# Altium project Driver.PrjPcb
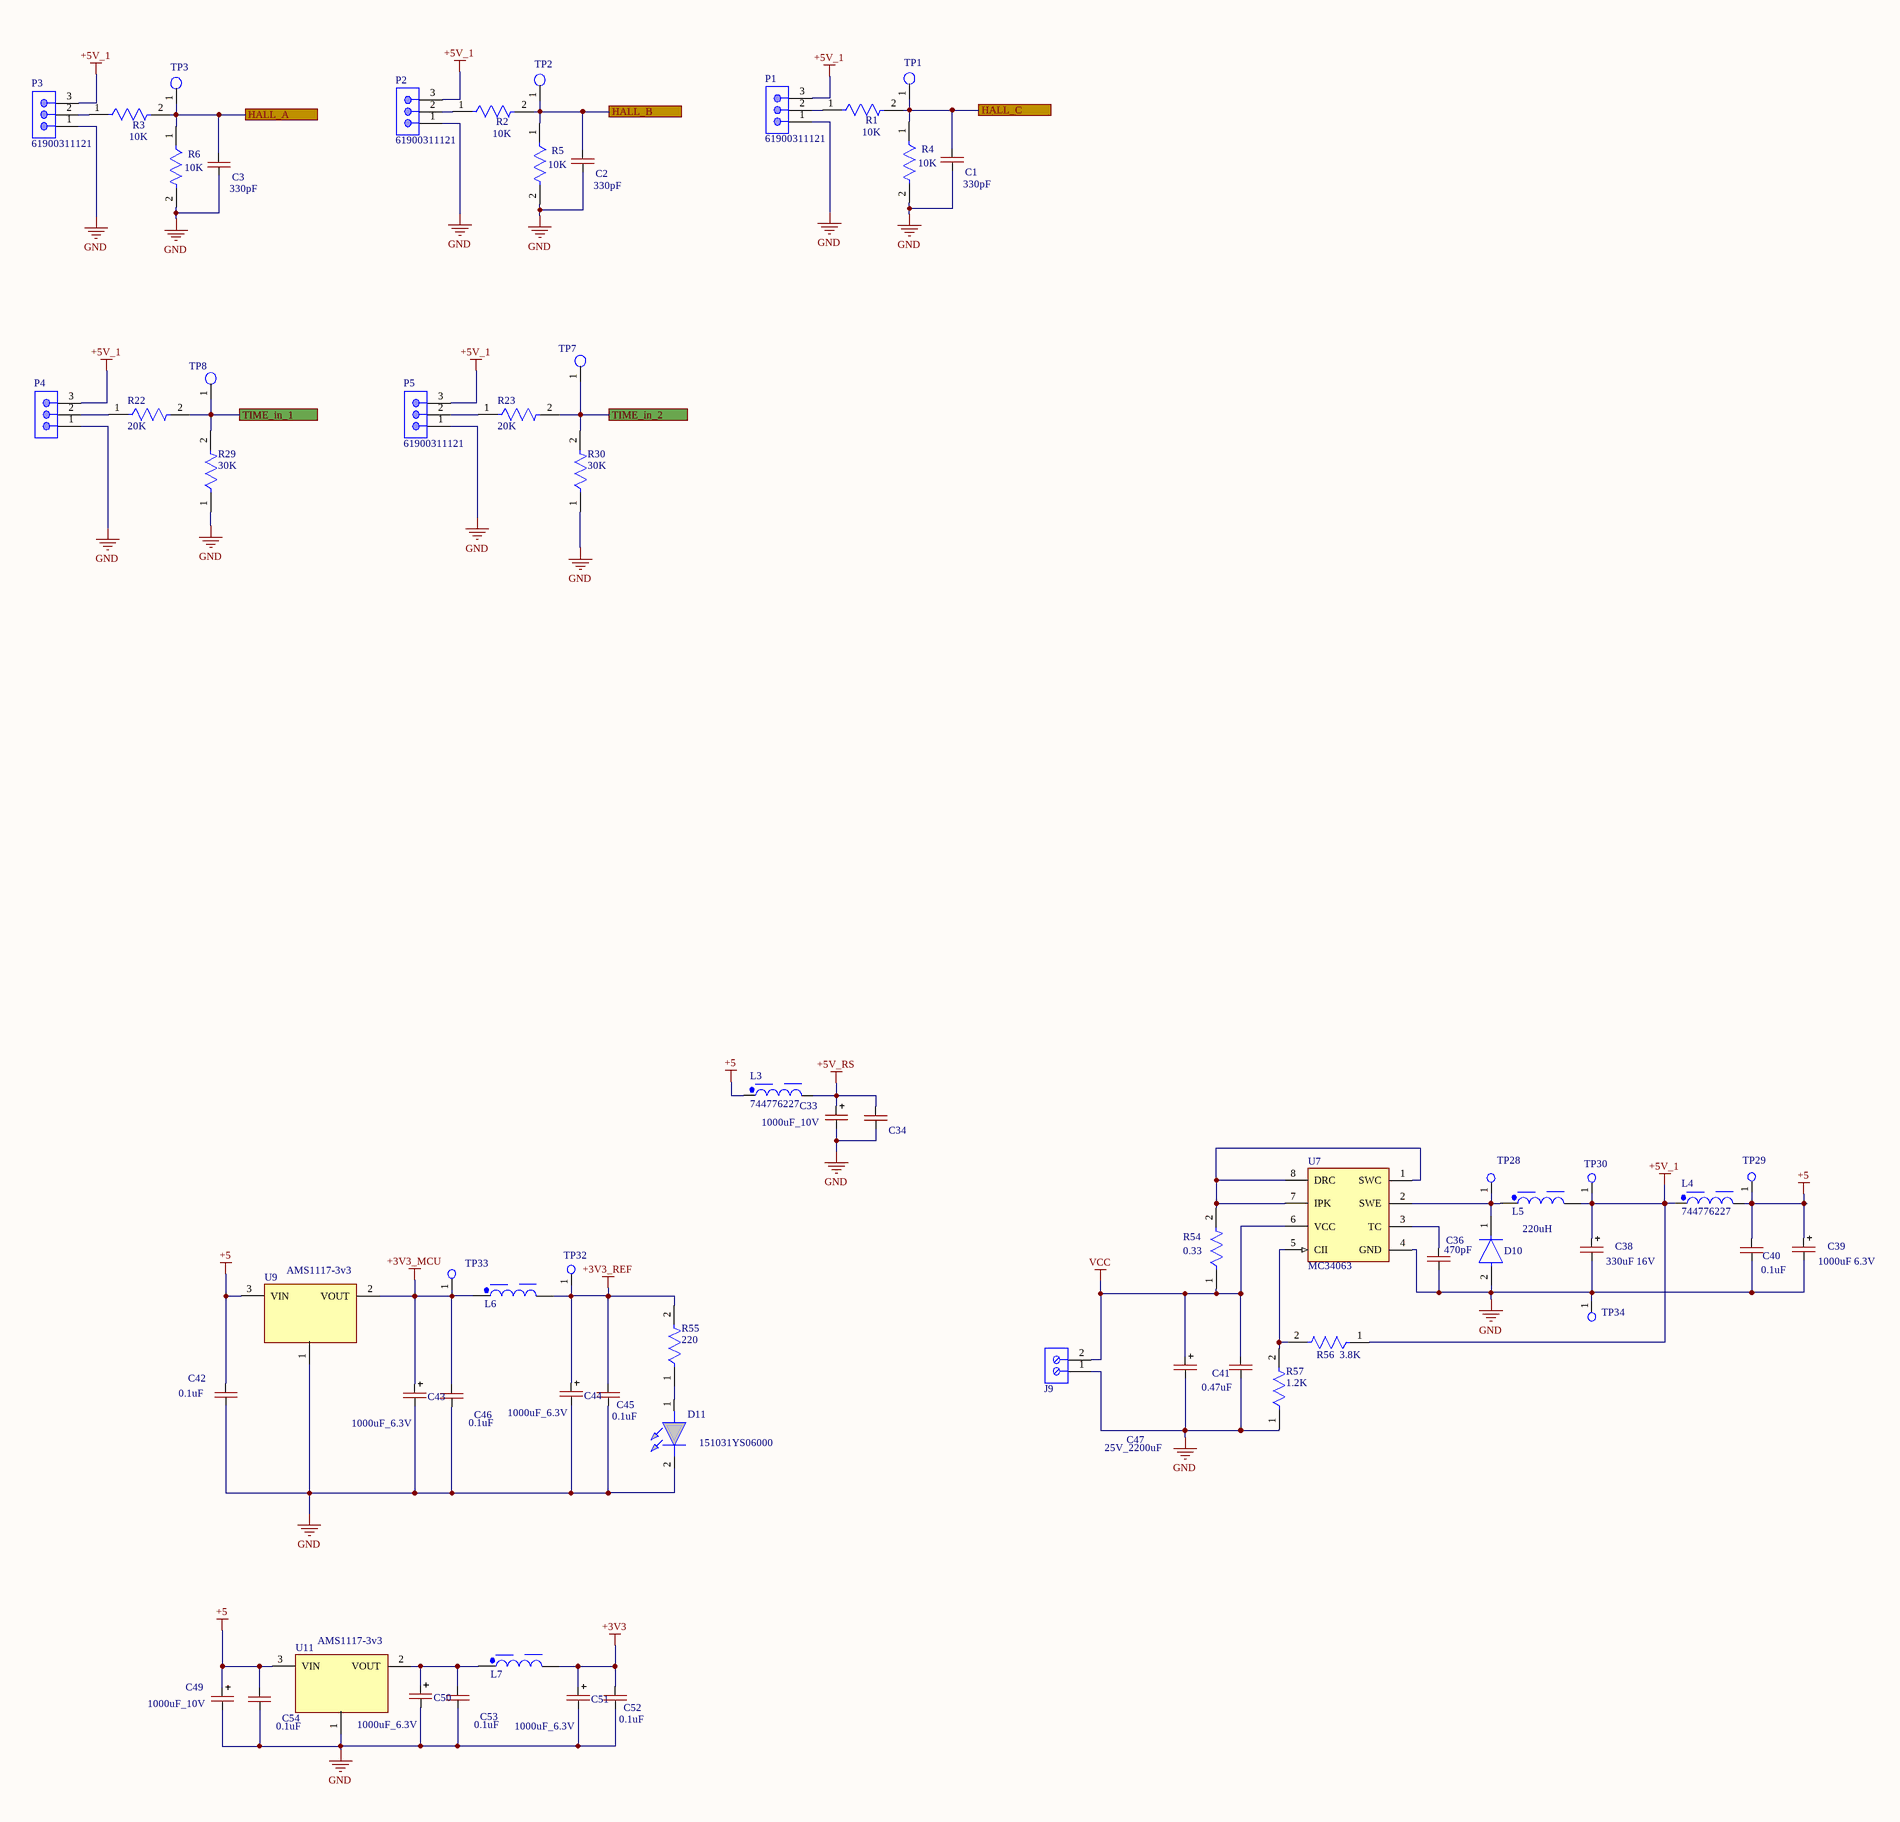
[diagram p0: Driver.SchDoc, top column 1 of 4]
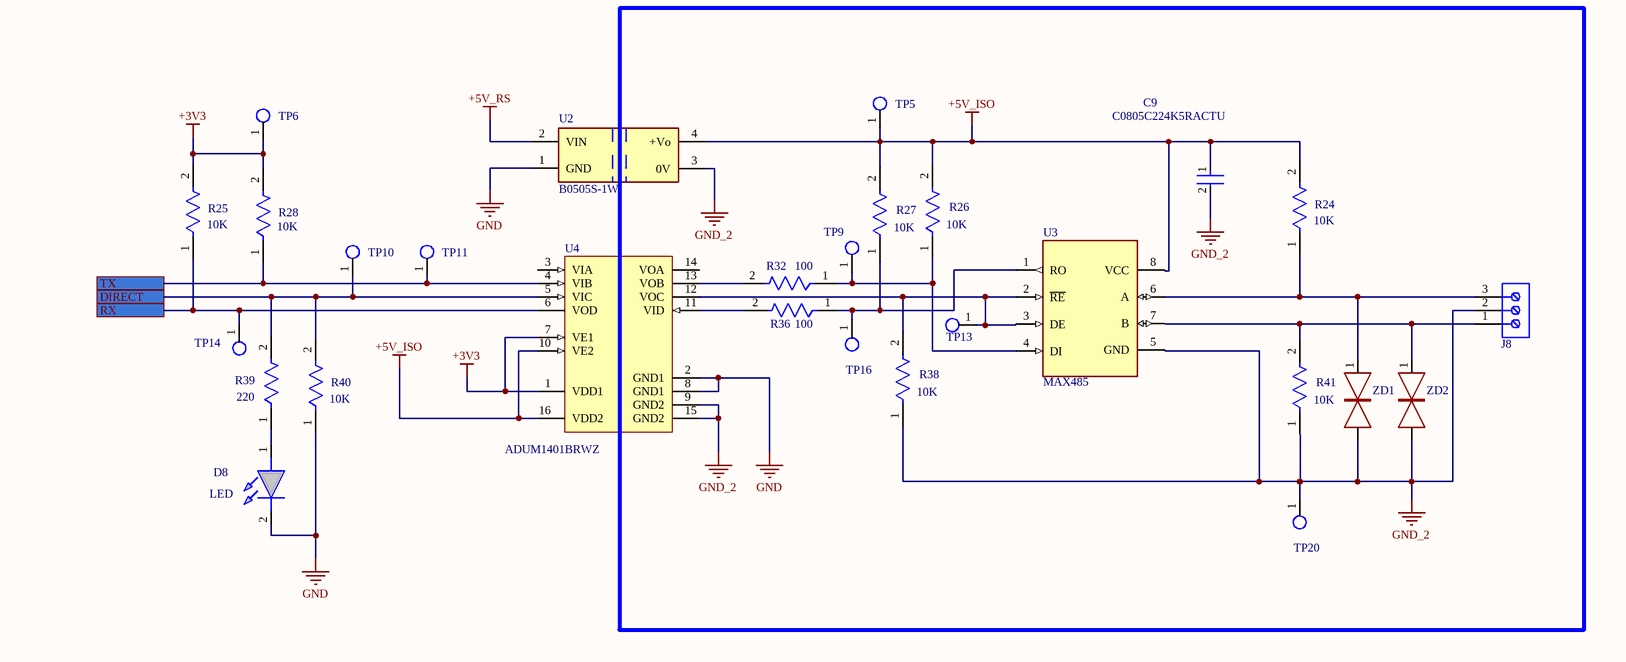
[diagram p1: Driver.SchDoc, top column 2 of 4]
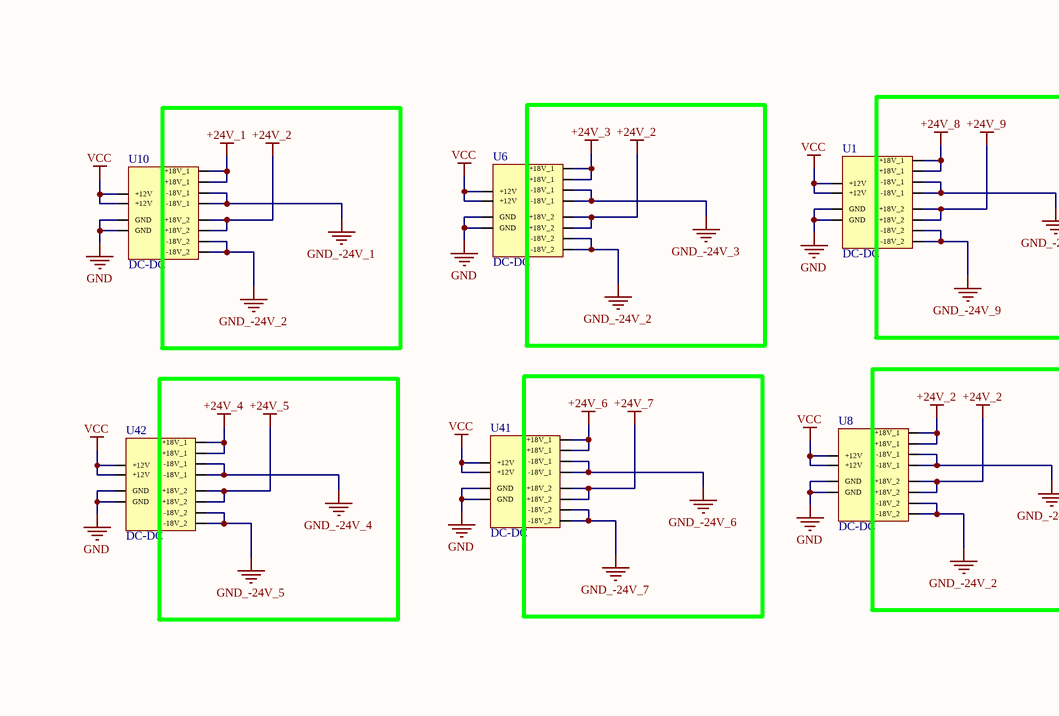
[diagram p2: Driver.SchDoc, top column 3 of 4]
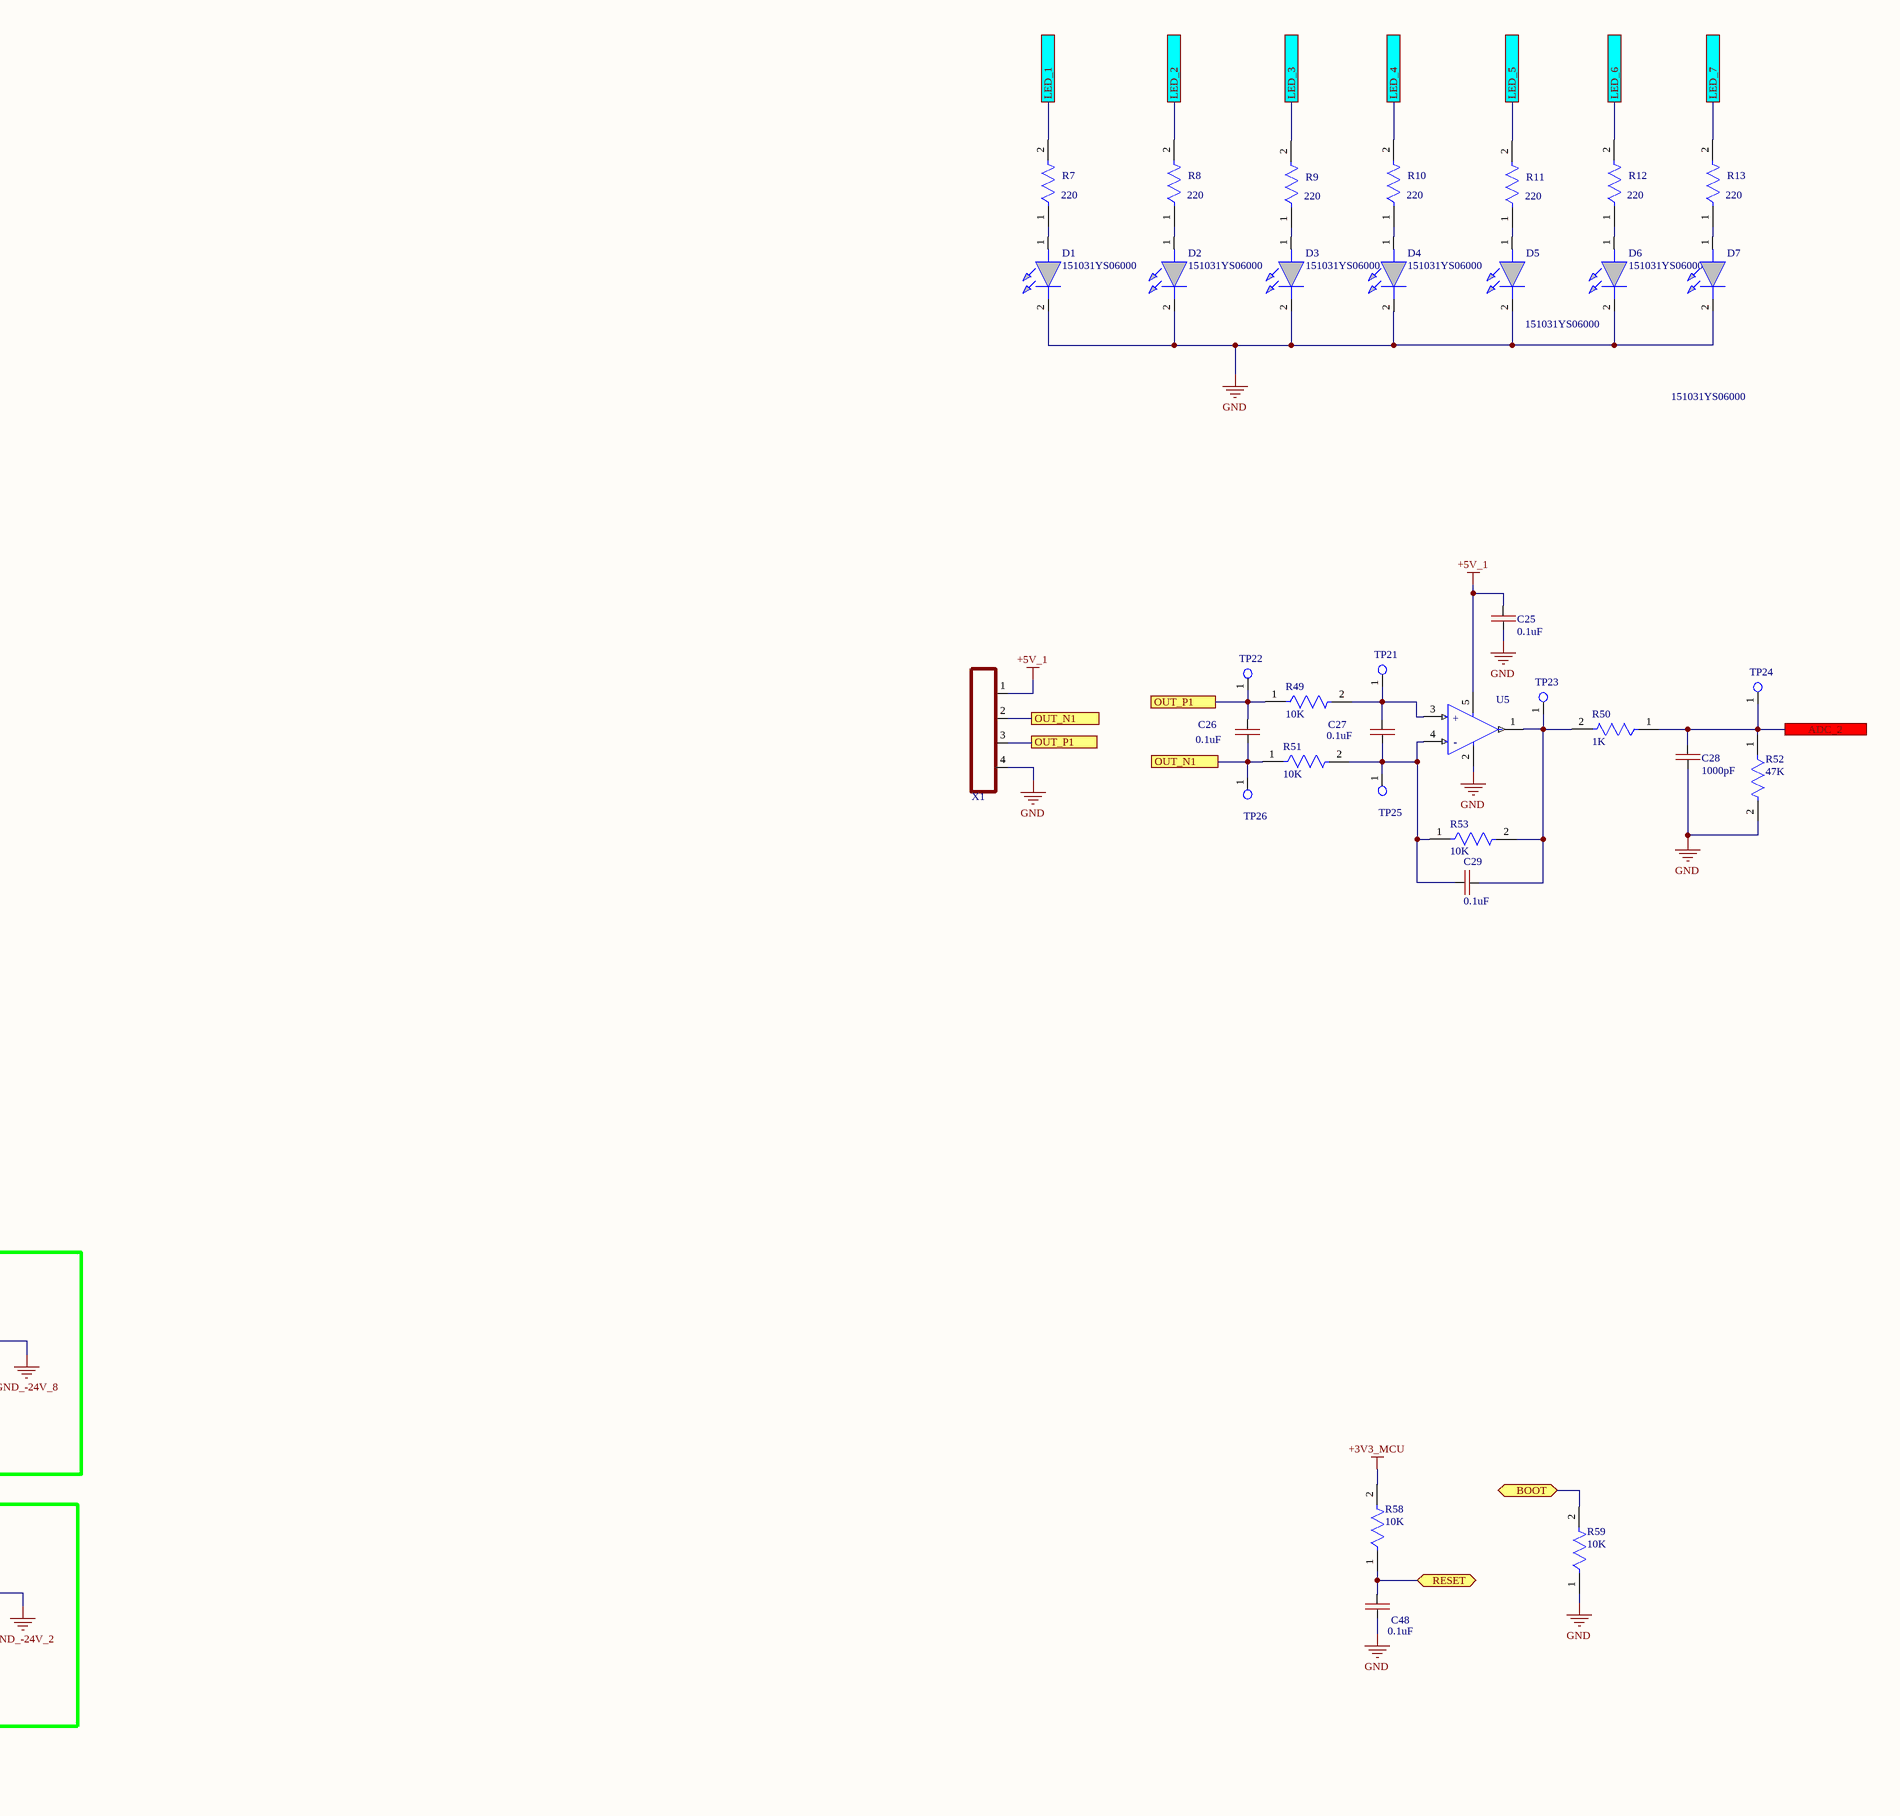
[diagram p3: Driver.SchDoc, top column 4 of 4]
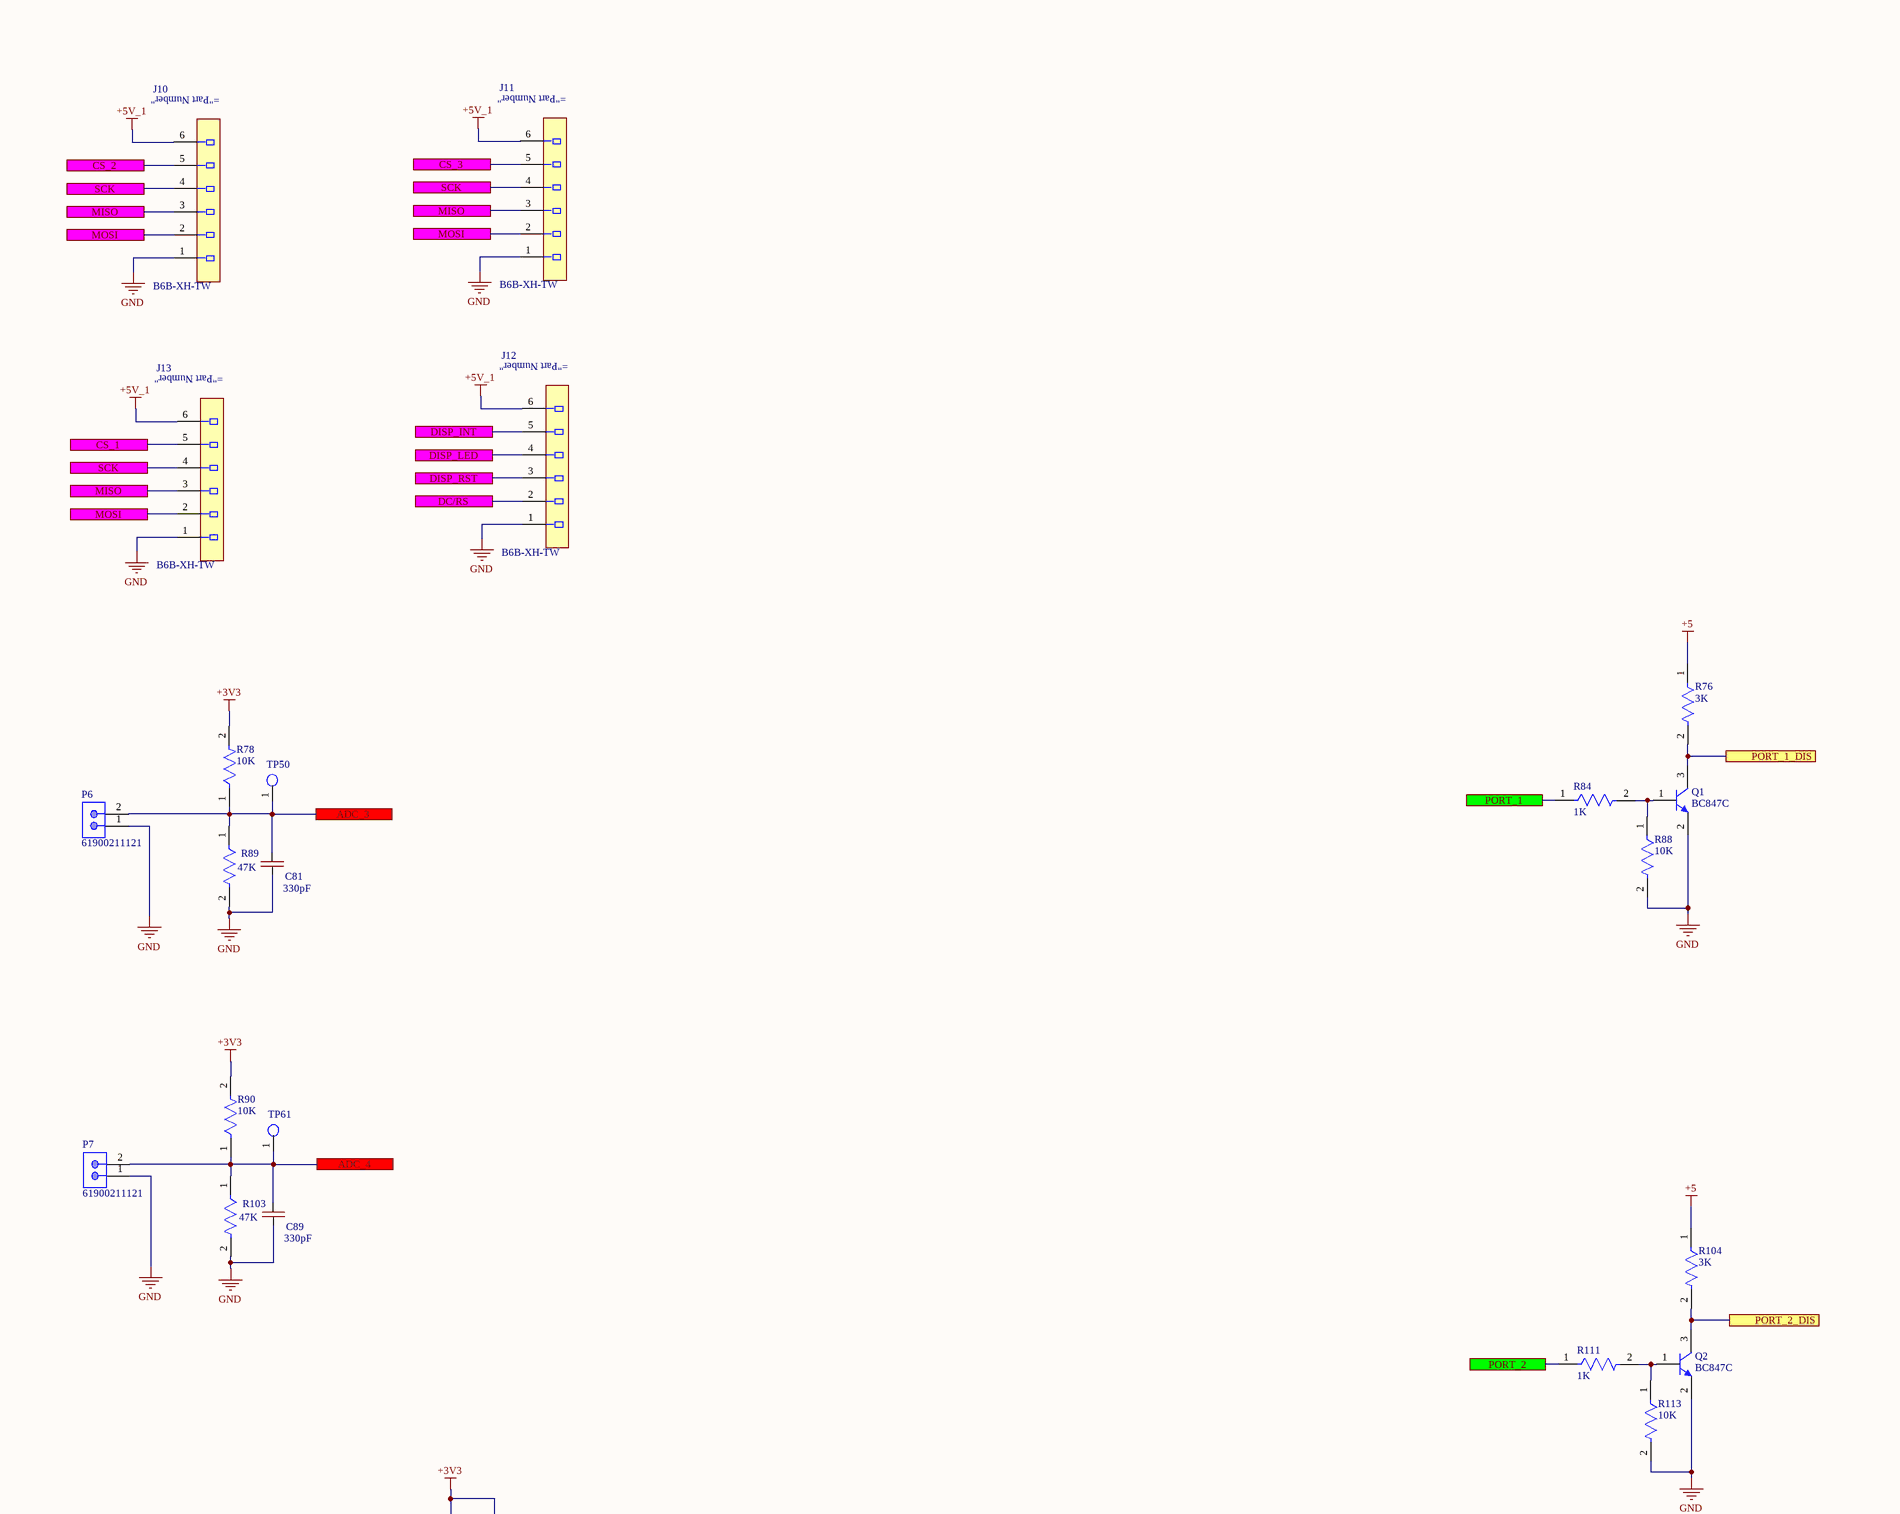
[diagram p4: Driver.SchDoc, centre column 1 of 4]
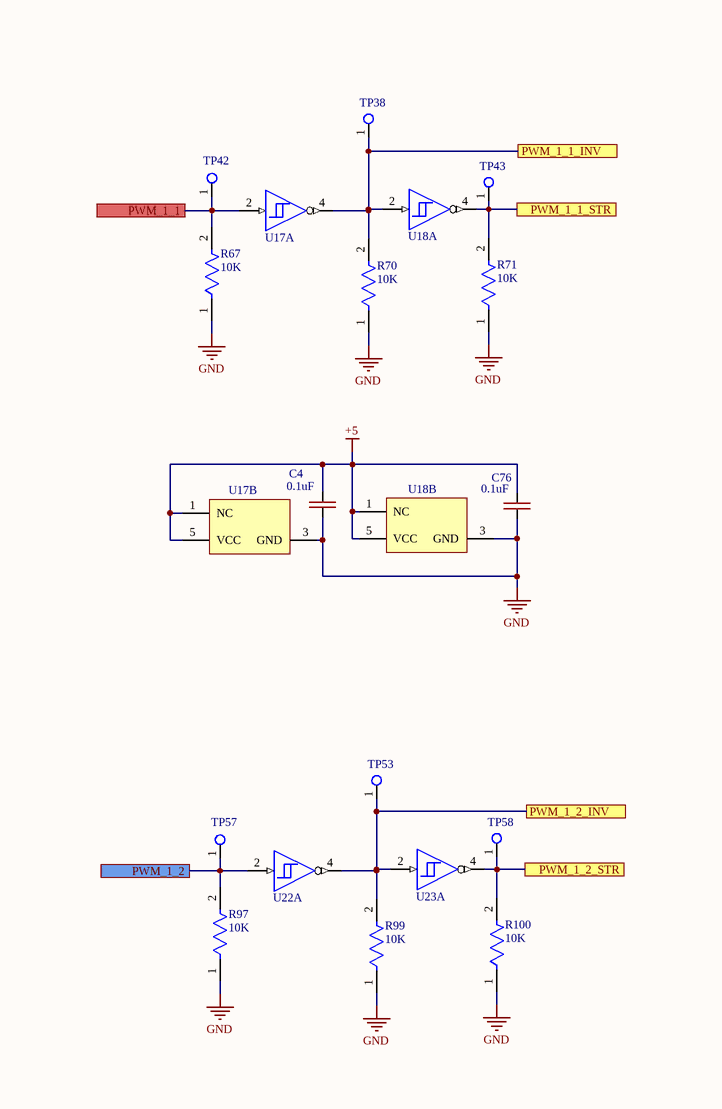
[diagram p5: Driver.SchDoc, centre column 2 of 4]
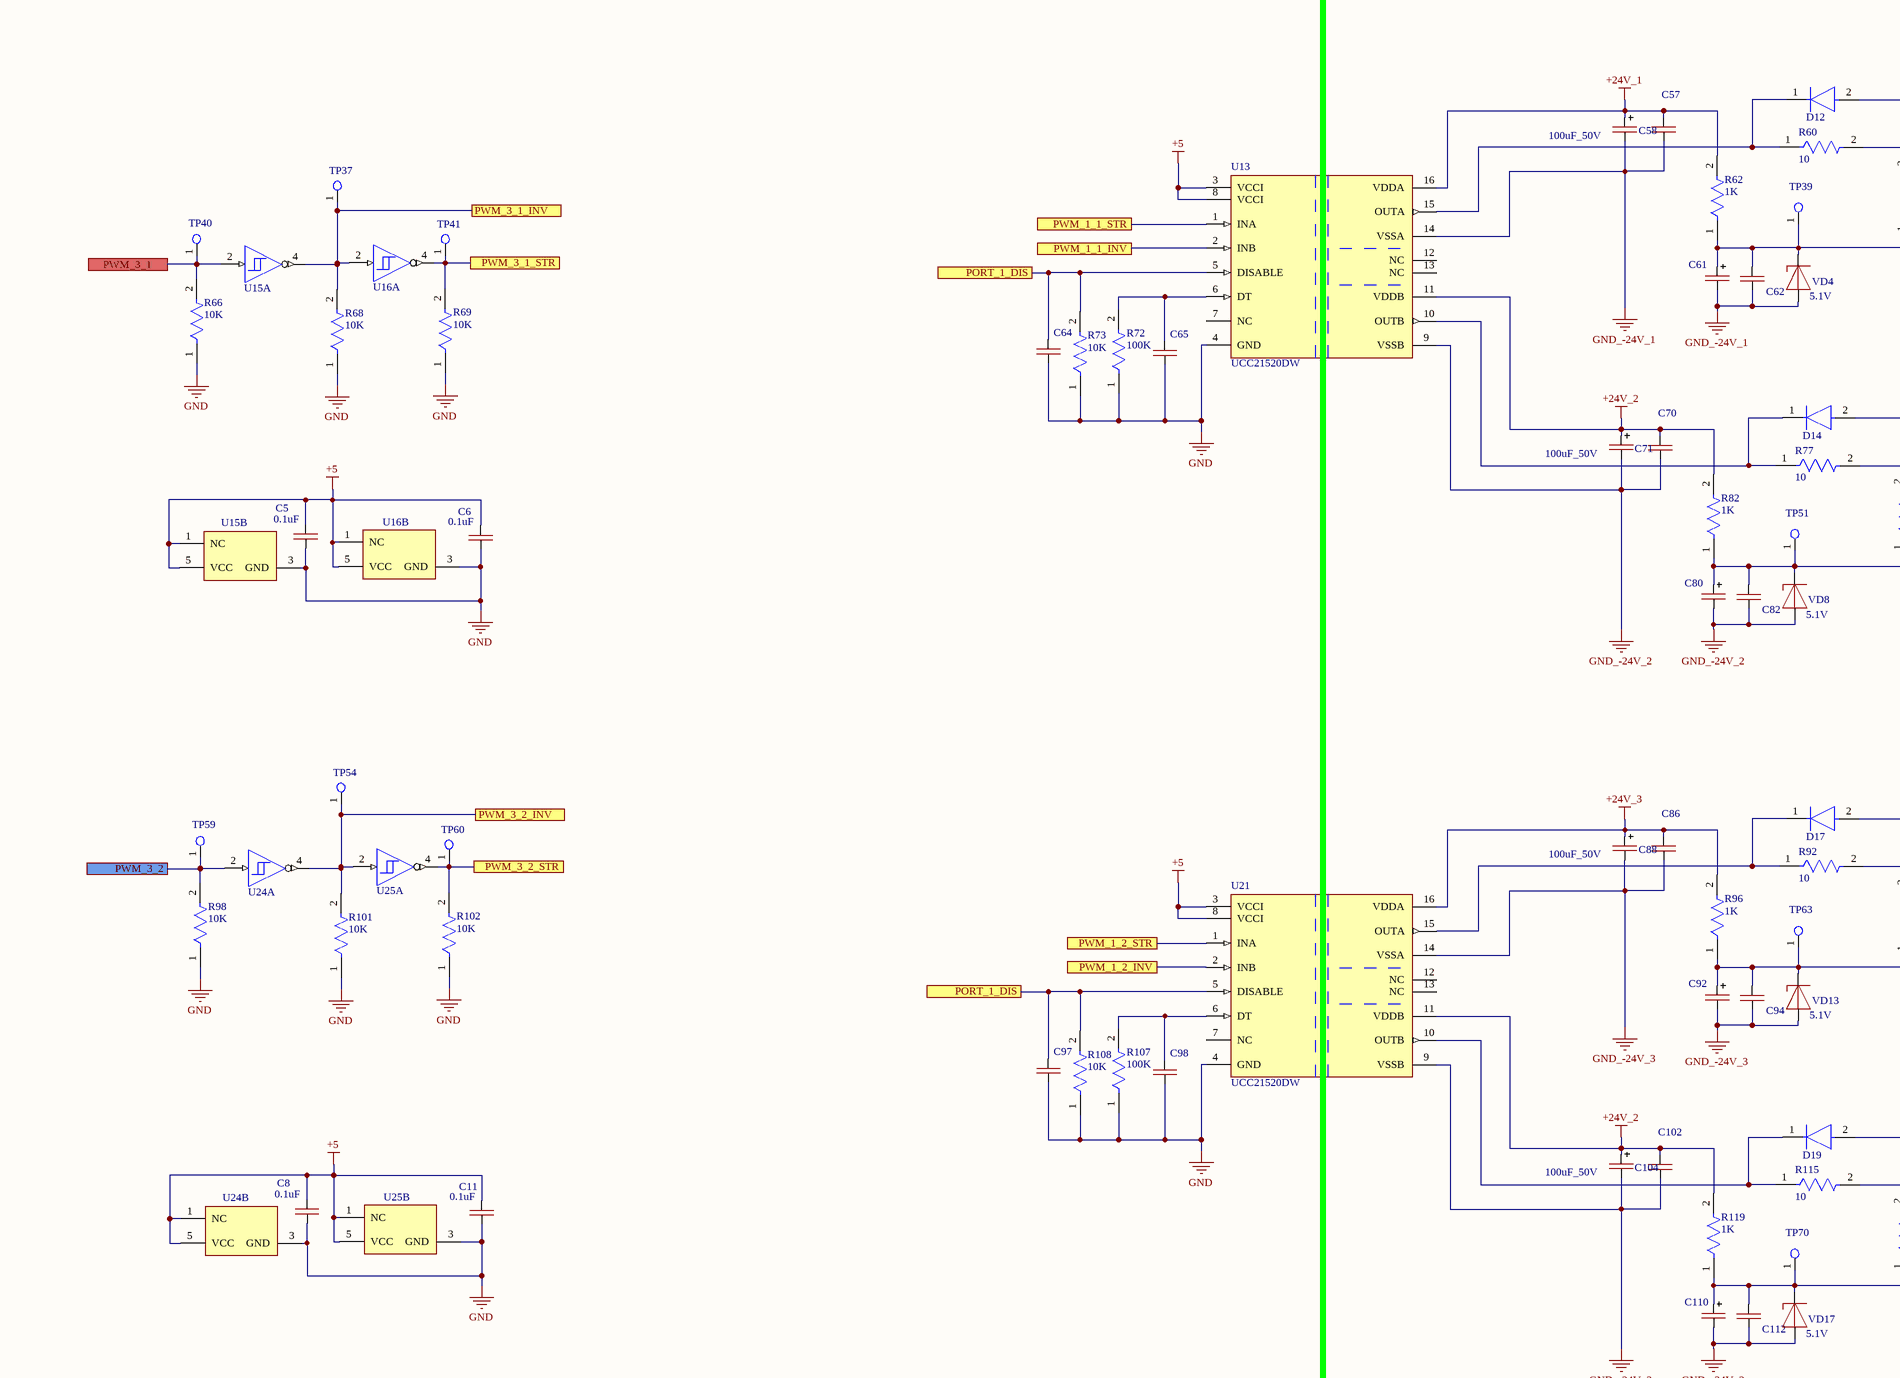
[diagram p6: Driver.SchDoc, centre column 3 of 4]
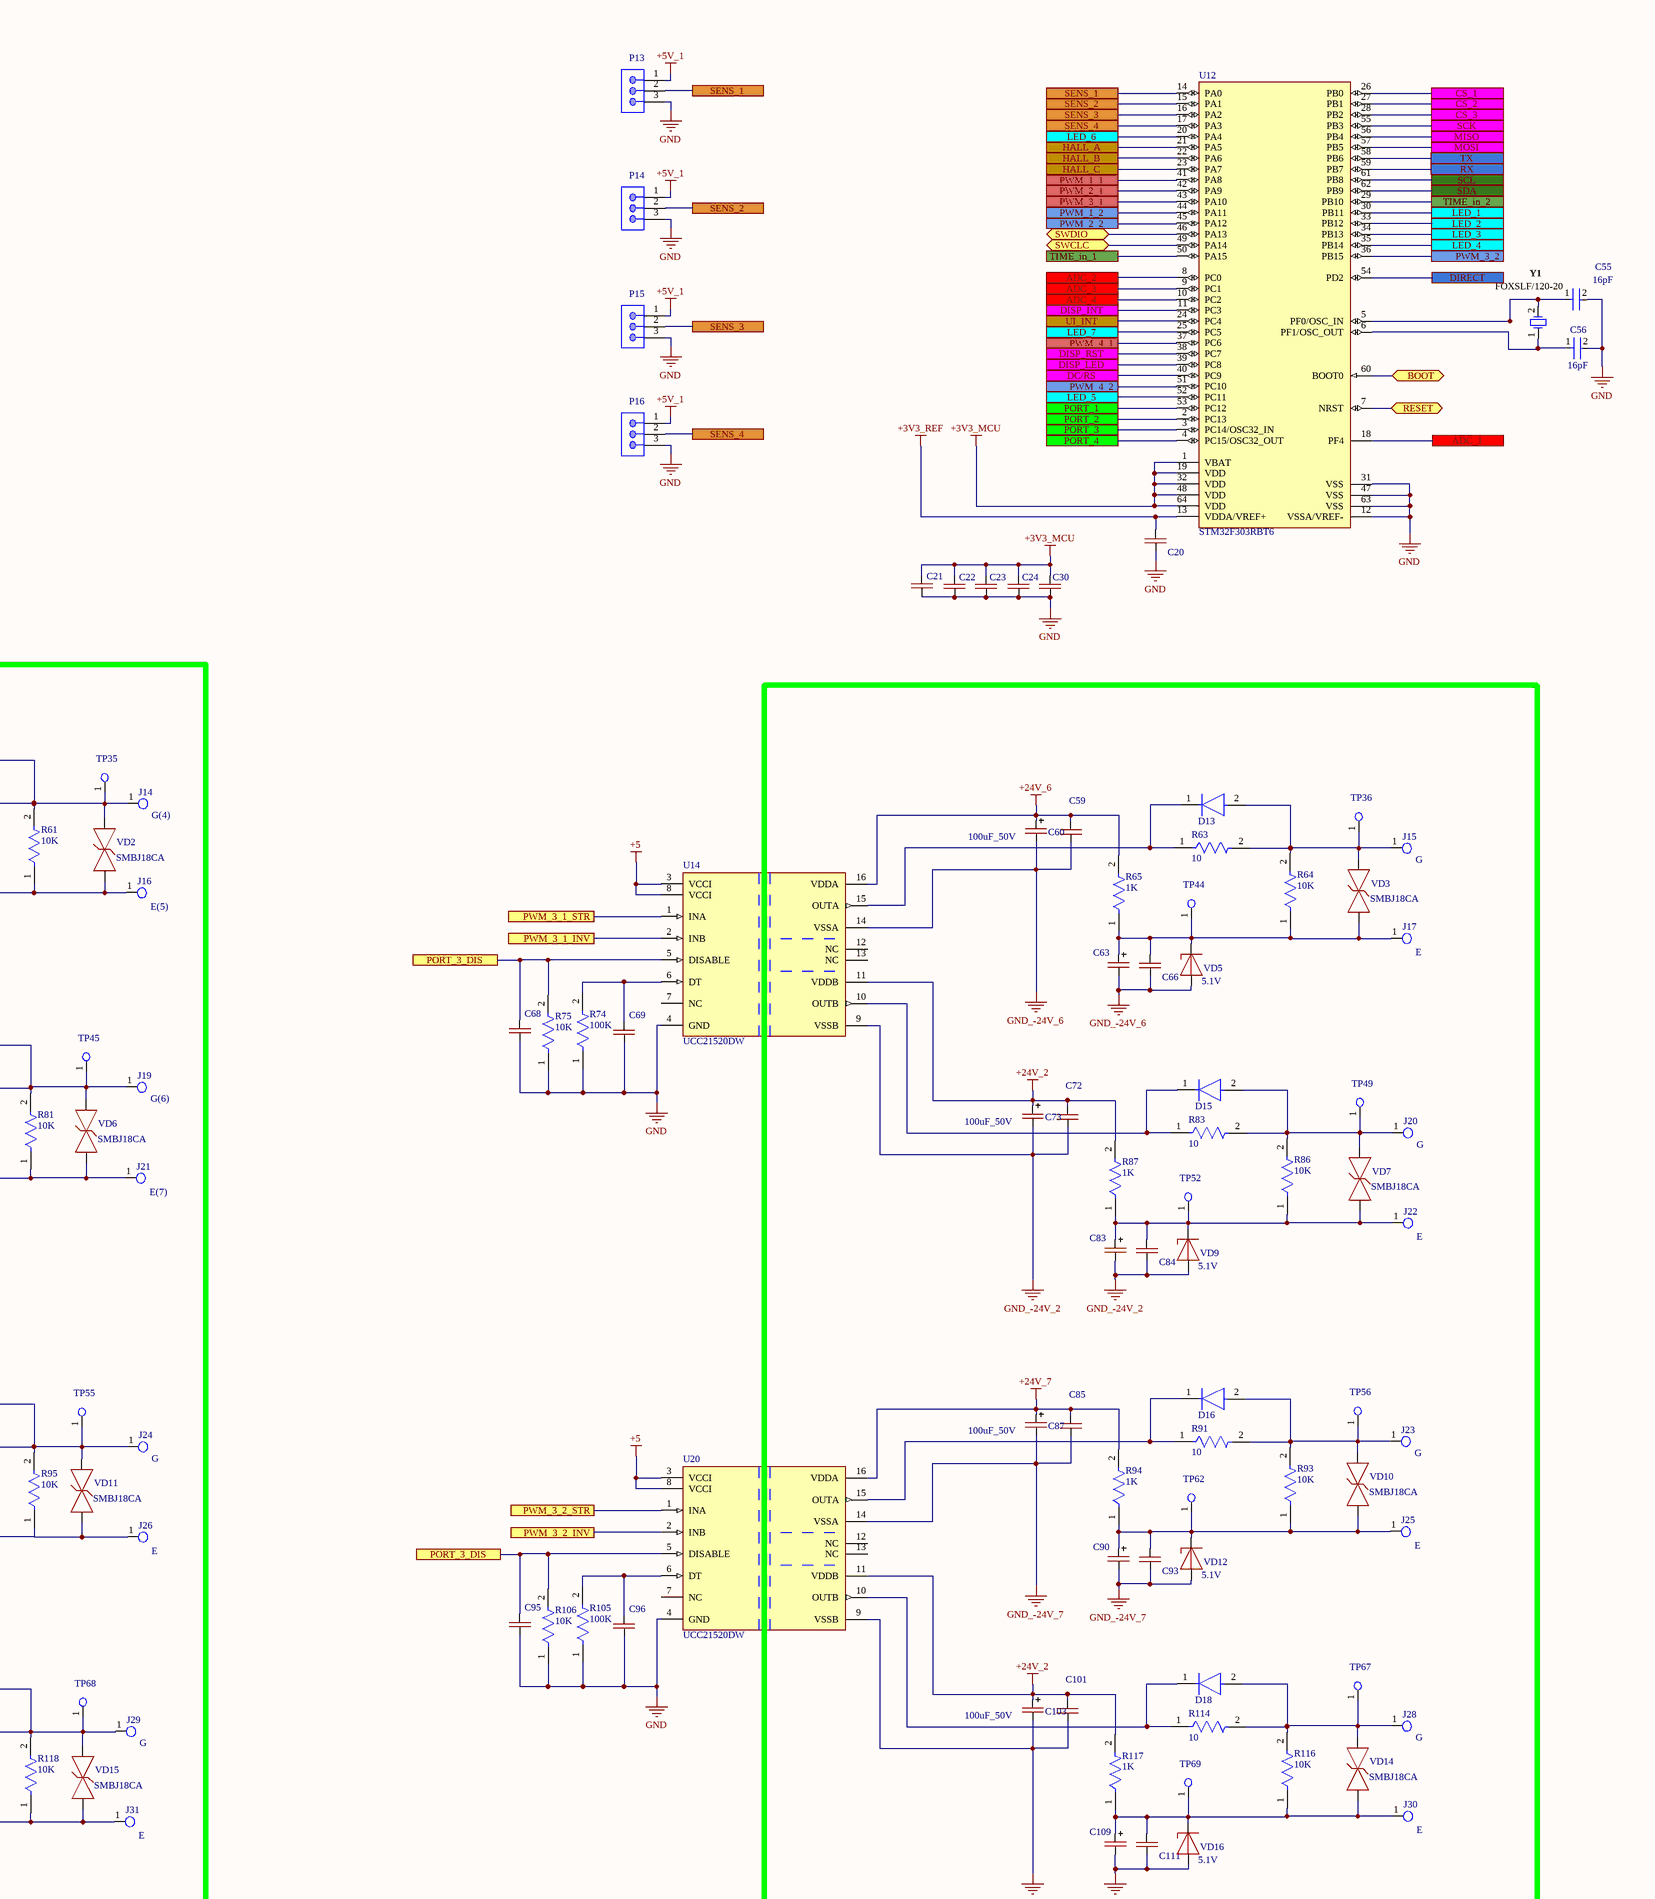
[diagram p7: Driver.SchDoc, centre column 4 of 4]
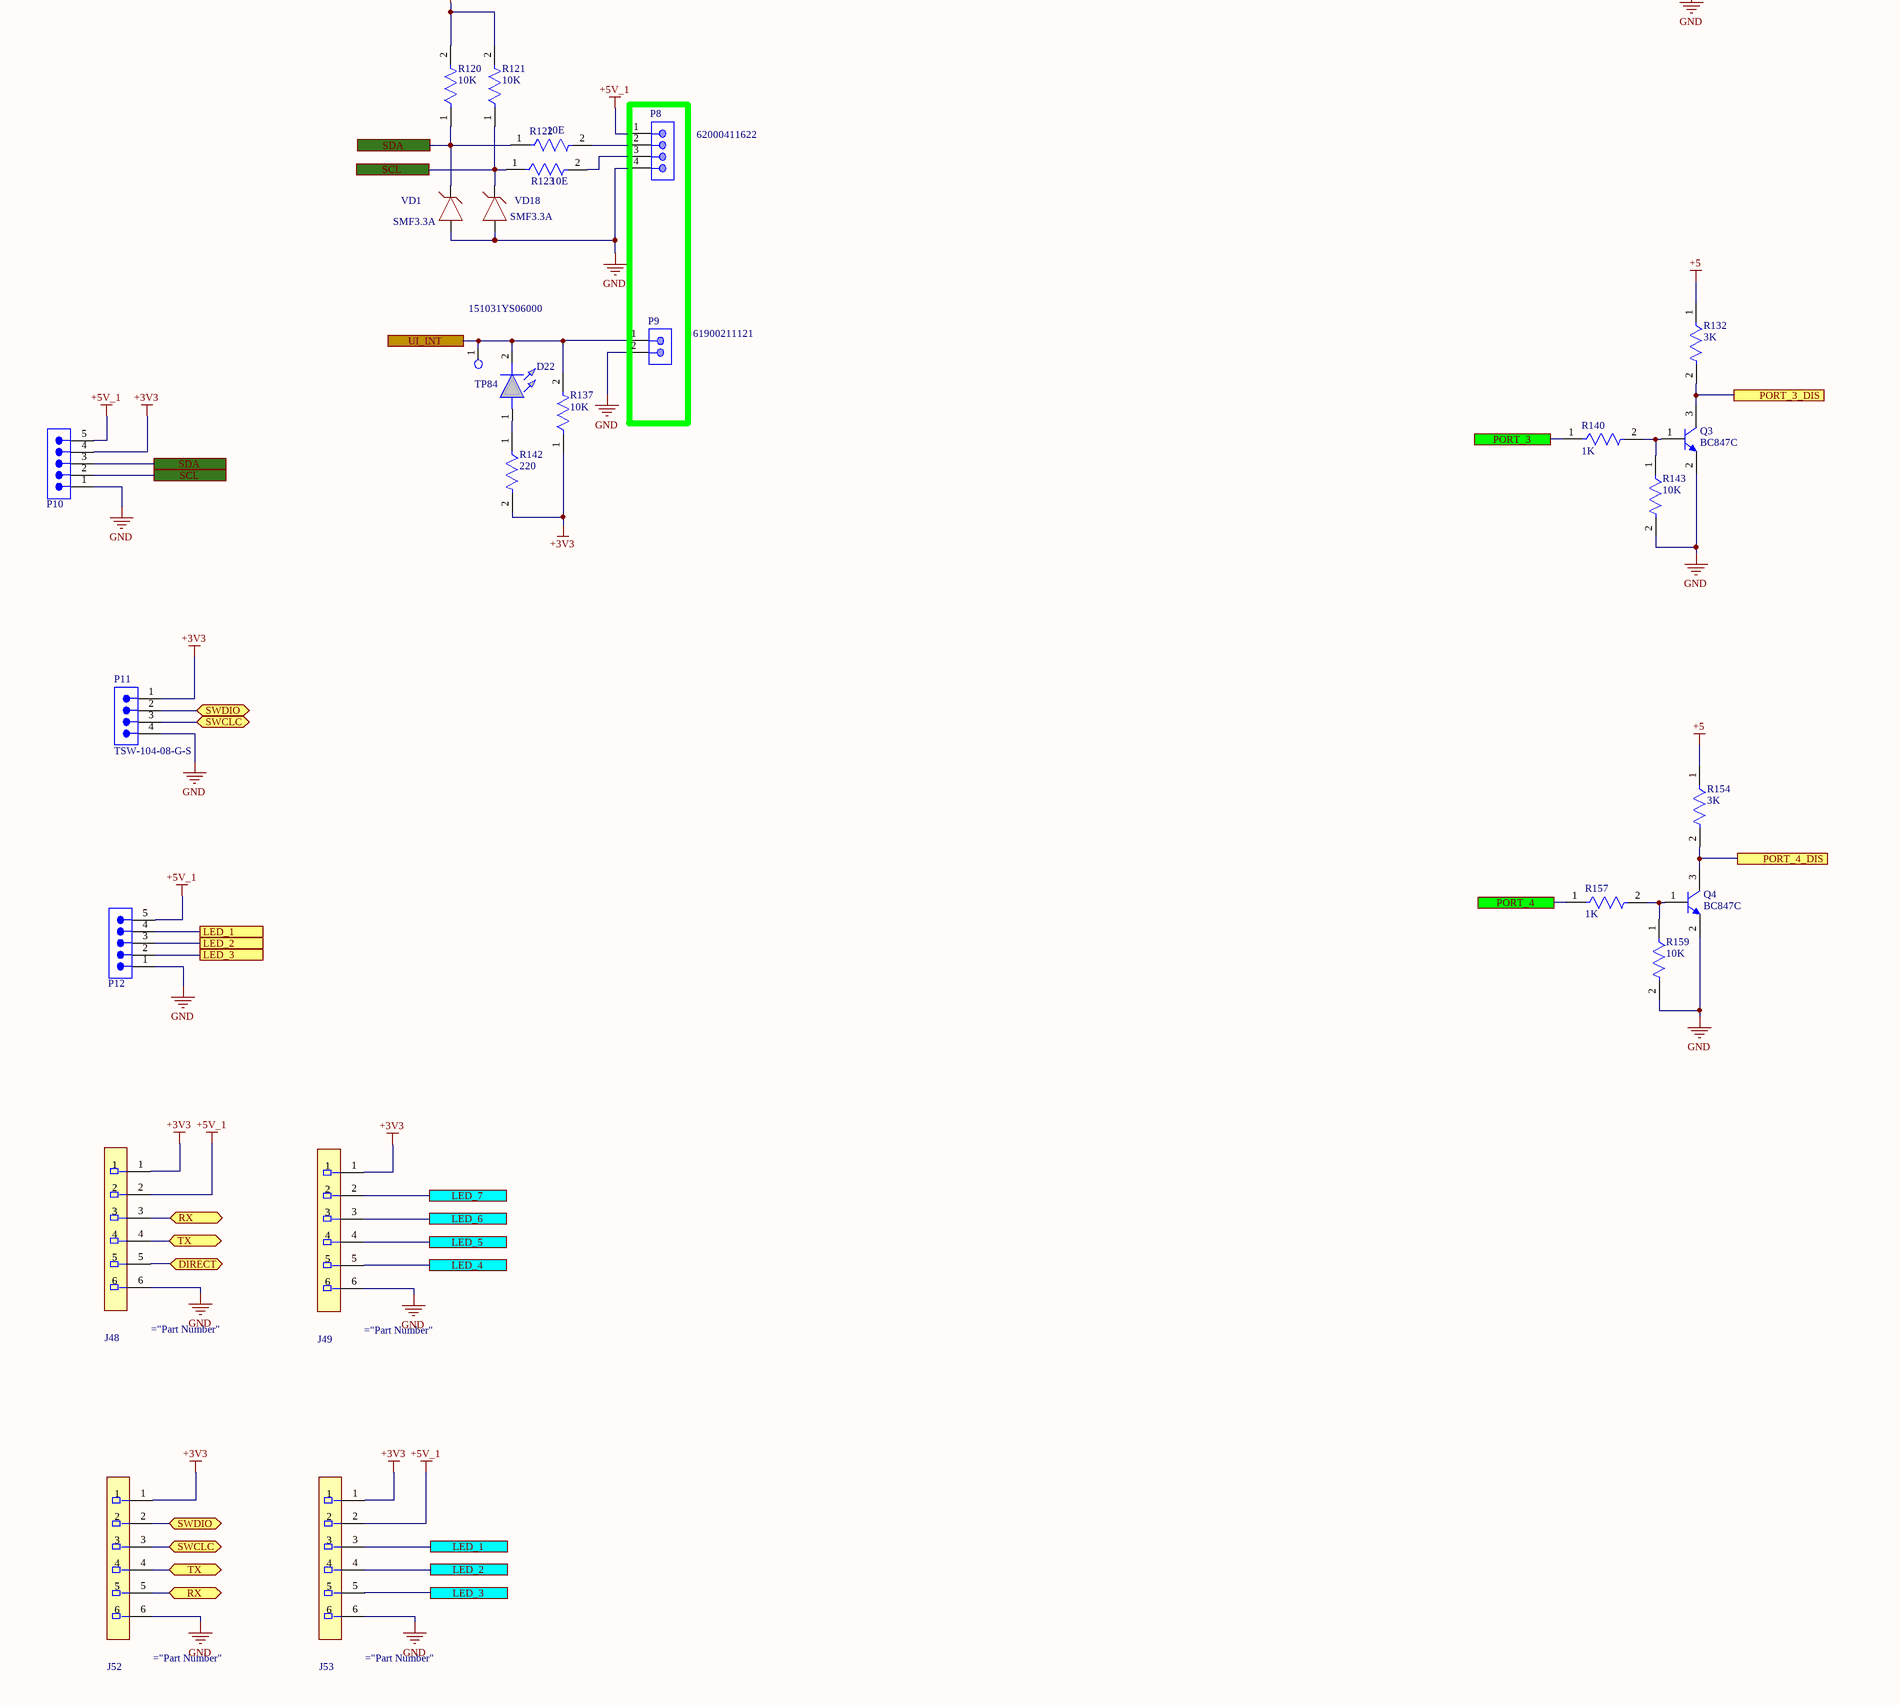
[diagram p8: Driver.SchDoc, bottom column 1 of 4]
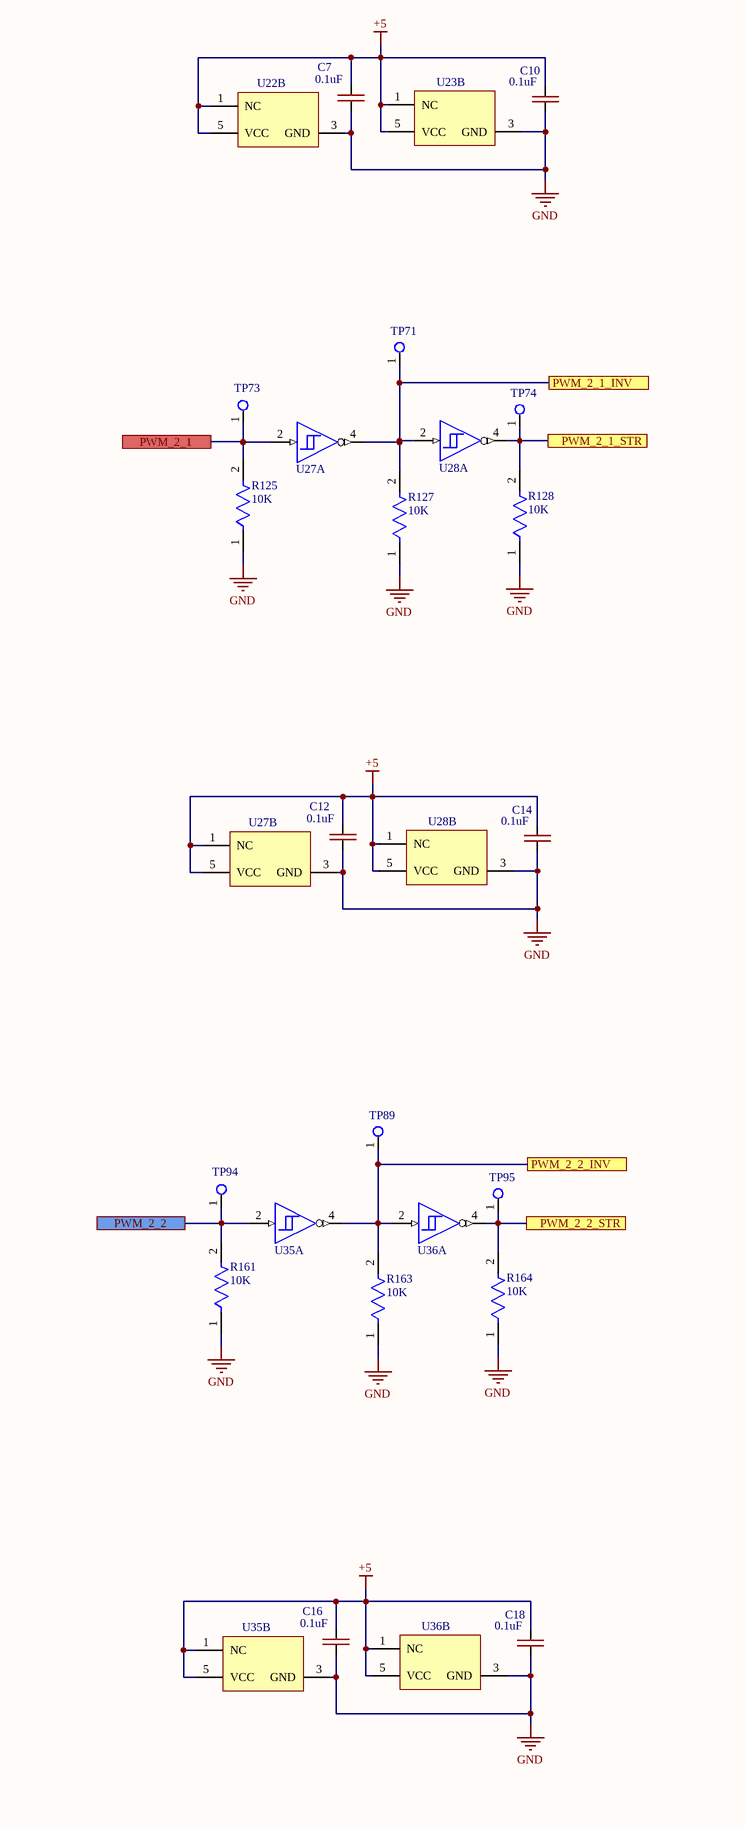
[diagram p9: Driver.SchDoc, bottom column 2 of 4]
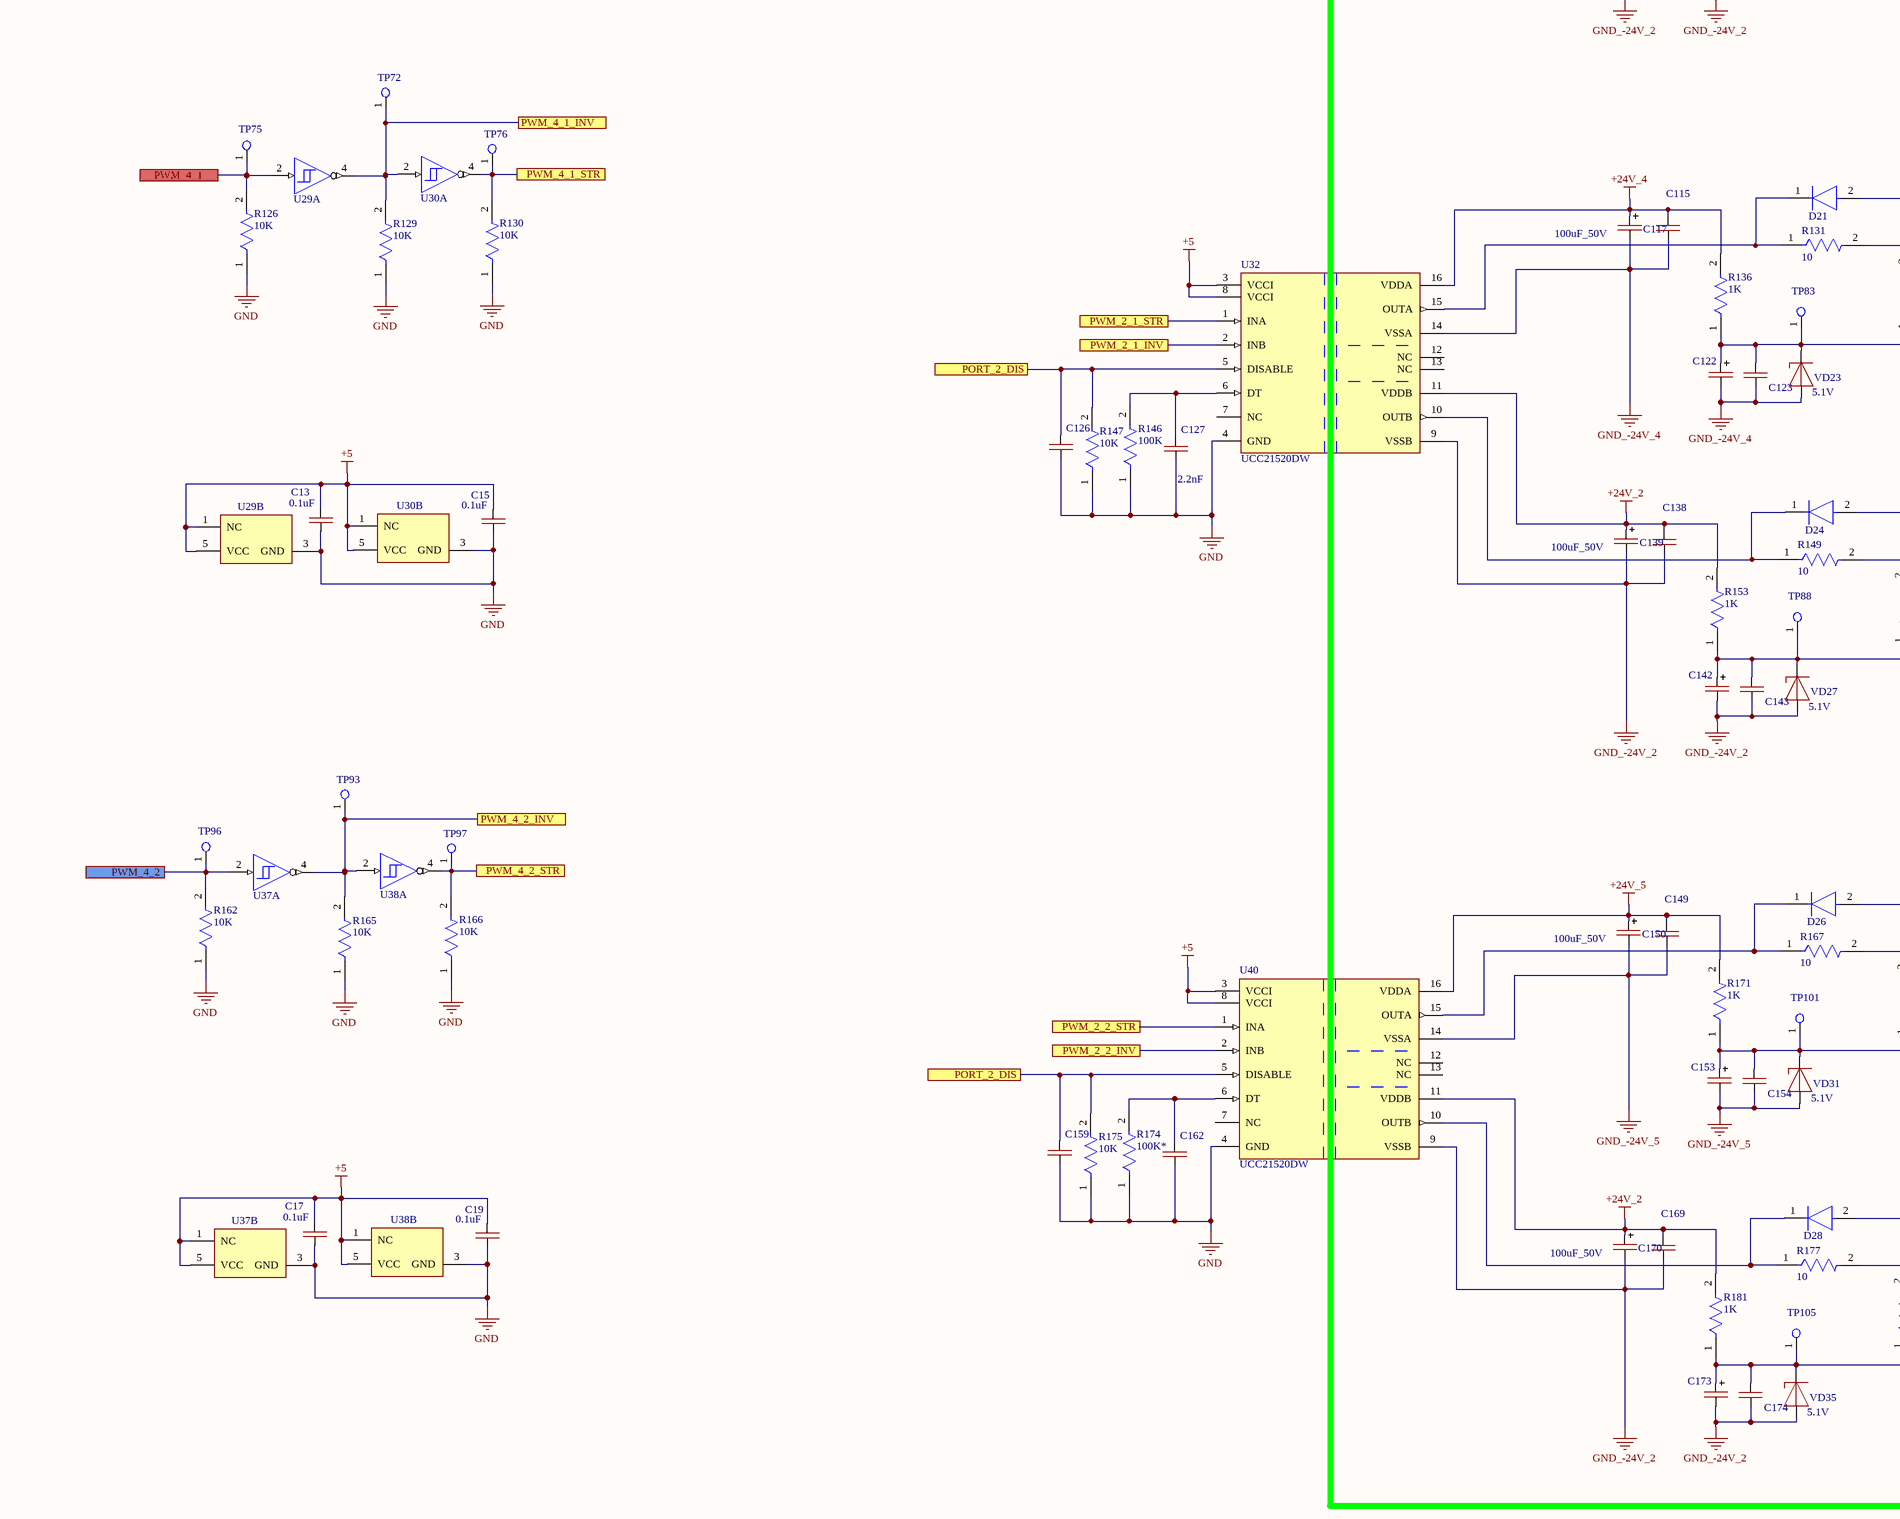
[diagram p10: Driver.SchDoc, bottom column 3 of 4]
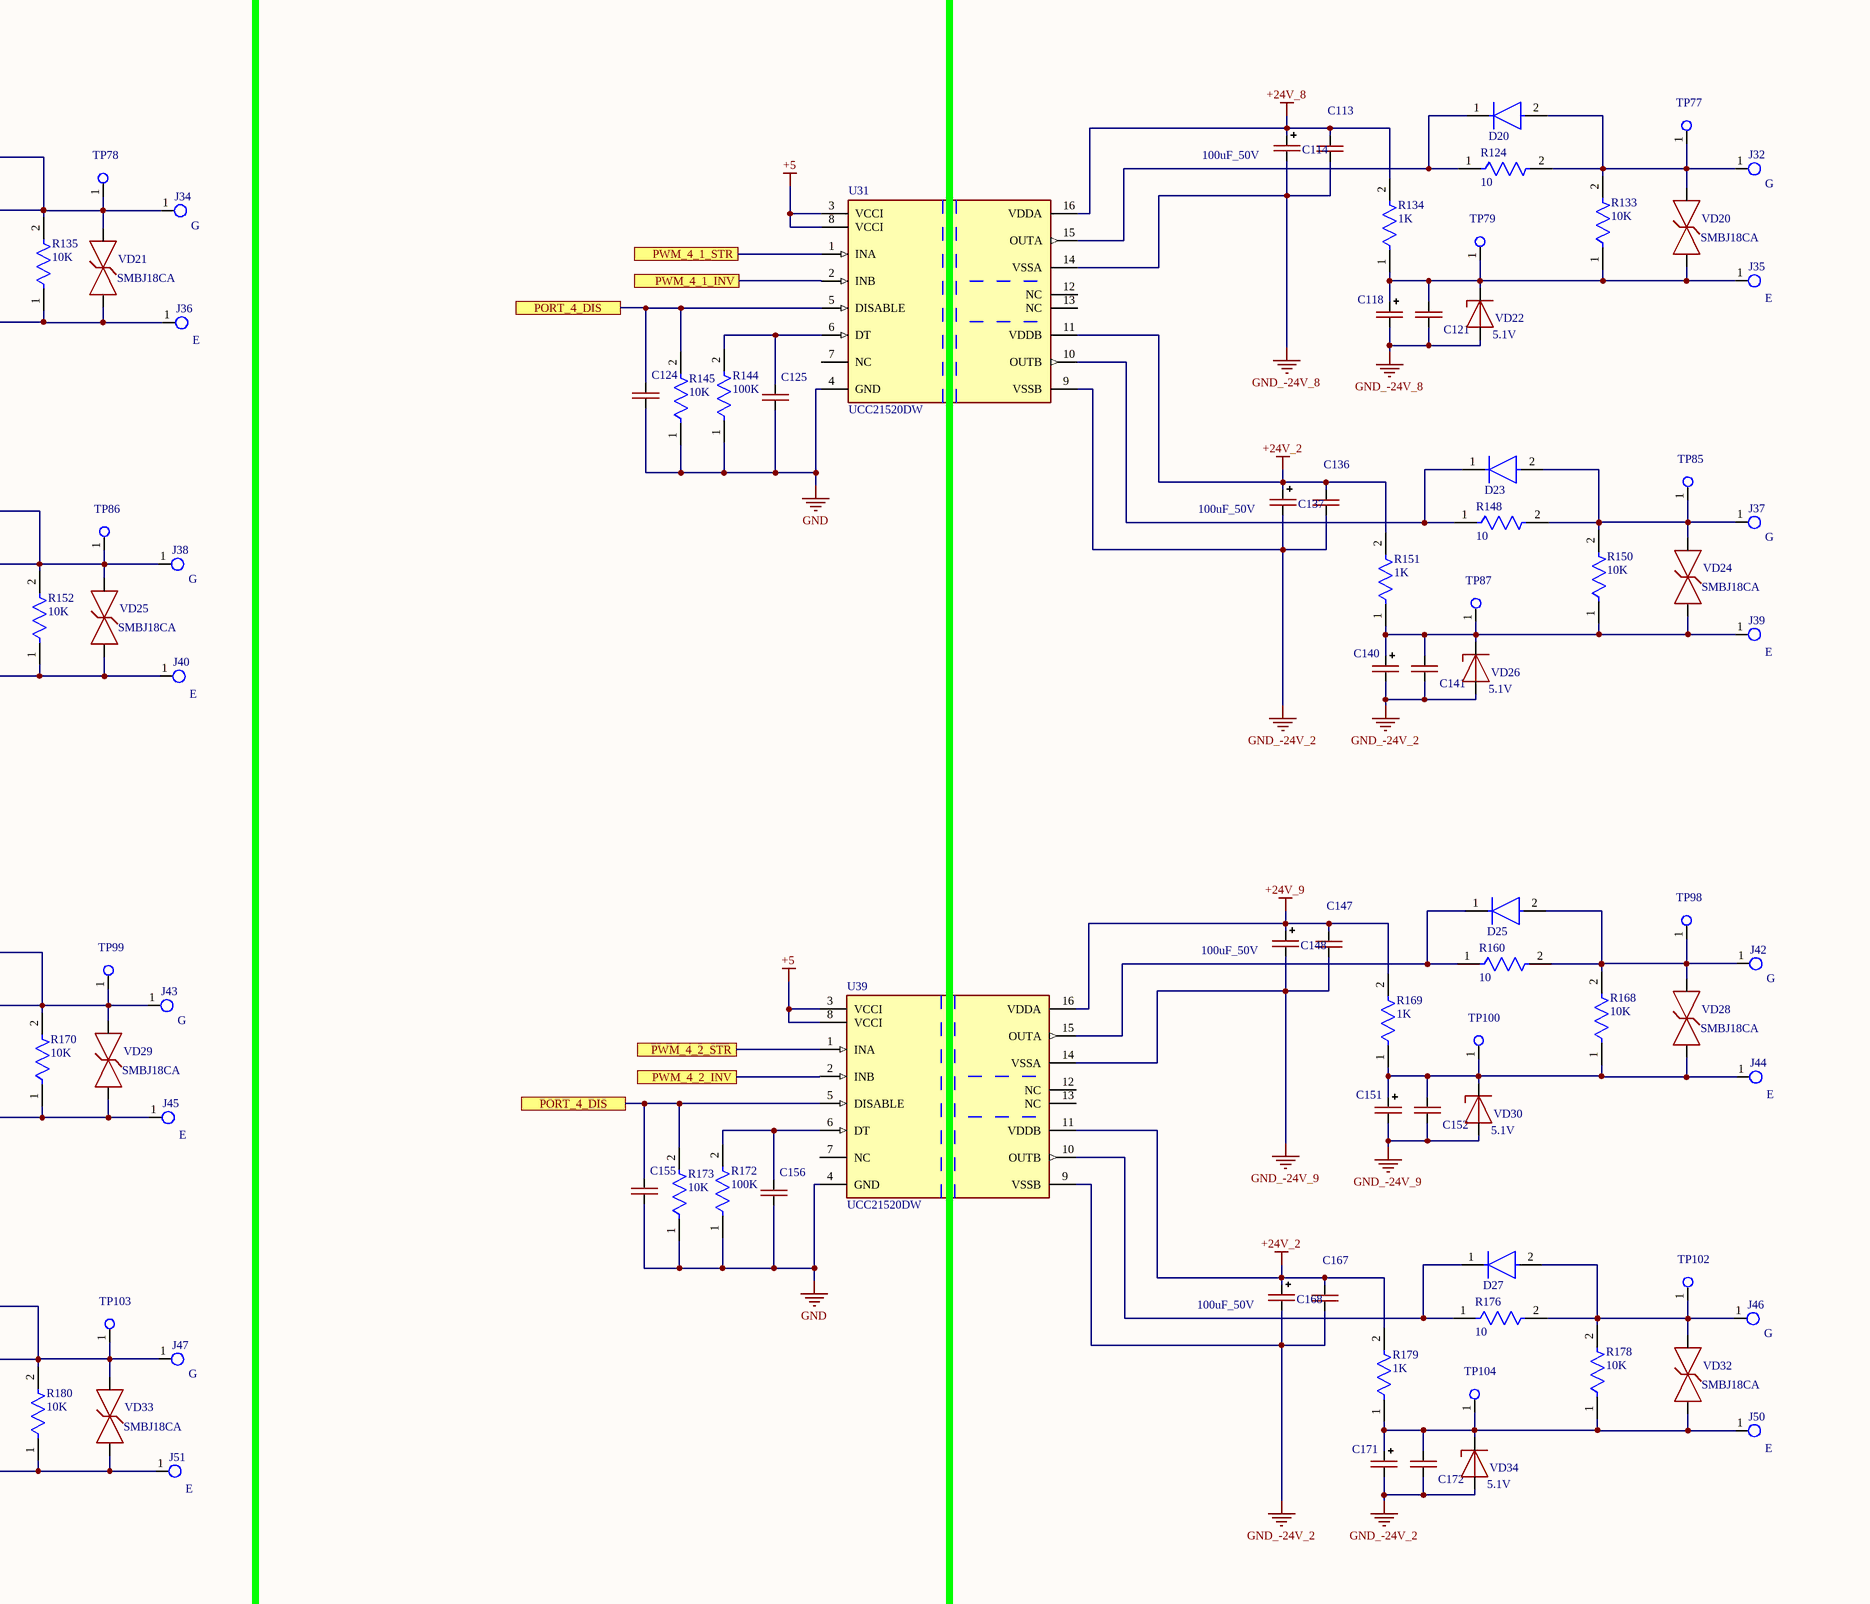
[diagram p11: Driver.SchDoc, bottom column 4 of 4]
1 sheet, 539 parts. Net scope: flat (ports and power ports of the same name join across sheets).
Board file: Driver.PcbDoc

## Sheet Driver.SchDoc
size 1600 x 1200 mm; SheetNumber: 1; SheetTotal: 1; SPICEModelCacheBTRAQOWF: <root> / <DocumentId>BTRAQOWF</DocumentId> / <CacheFrame Number="0"> / <Model Name="7850_74477530_1m" Kind="CKT"> / <Text>******* / .subckt 7850_74477530_1m 1 2 / Rp 1 2 187304.915771 / Cp 1 2 4.36976277949p / Rs 1 N3 3.3 / L1 N3 2 1000u / .ends 7850_74477530_1m</Text> / </Model> / </CacheFrame> / </root>

### Parts
C1  330pF  [CAP-0805]
C2  330pF  [CAP-0805]
C3  330pF  [CAP-0805]
C4  0.1uF  [CAP-0805]
C5  0.1uF  [CAP-0805]
C6  0.1uF  [CAP-0805]
C7  0.1uF  [CAP-0805]
C8  0.1uF  [CAP-0805]
C9  C0805C224K5RACTU  [FP-C0805C-DN-MFG]
C10  0.1uF  [CAP-0805]
C11  0.1uF  [CAP-0805]
C12  0.1uF  [CAP-0805]
C13  0.1uF  [CAP-0805]
C14  0.1uF  [CAP-0805]
C15  0.1uF  [CAP-0805]
C16  0.1uF  [CAP-0805]
C17  0.1uF  [CAP-0805]
C18  0.1uF  [CAP-0805]
C19  0.1uF  [CAP-0805]
C20  CAP-NON-POLAR  [CAP-0805]  (value not drawn)
C21  CAP-NON-POLAR  [CAP-0805]  (value not drawn)
C22  CAP-NON-POLAR  [CAP-0805]  (value not drawn)
C23  CAP-NON-POLAR  [CAP-0805]  (value not drawn)
C24  CAP-NON-POLAR  [CAP-0805]  (value not drawn)
C25  0.1uF  [CAP-0805]
C26  0.1uF  [CAP-0805]
C27  0.1uF  [CAP-0805]
C28  1000pF  [CAP-0805]
C29  0.1uF  [CAP-0805]
C30  CAP-NON-POLAR  [CAP-0805]  (value not drawn)
C33  1000uF_10V  [CAP_SMD_Size_G]
C34  CAP-NON-POLAR  [CAP-0805]  (value not drawn)
C36  470pF  [CAP-0805]
C38  330uF 16V  [CAP_SMD_Size_E]
C39  1000uF 6.3V  [CAP_SMD_Size_E]
C40  0.1uF  [CAP-0805]
C41  0.47uF  [CAP-0805]
C42  0.1uF  [CAP-0805]
C43  1000uF_6.3V  [CAP_SMD_Size_E]
C44  1000uF_6.3V  [CAP_SMD_Size_E]
C45  0.1uF  [CAP-0805]
C46  0.1uF  [CAP-0805]
C47  25V_2200uF  [HITANO 3300uF 25V  16x25]
C48  0.1uF  [CAP-0805]
C49  1000uF_10V  [CAP_SMD_Size_G]
C50  1000uF_6.3V  [CAP_SMD_Size_E]
C51  1000uF_6.3V  [CAP_SMD_Size_E]
C52  0.1uF  [CAP-0805]
C53  0.1uF  [CAP-0805]
C54  0.1uF  [CAP-0805]
C55  16pF  [FP-GRM21B-0_1-IPC_C]
C56  16pF  [FP-GRM21B-0_1-IPC_C]
C57  CAP-NON-POLAR  [CAP-0805]  (value not drawn)
C58  100uF_50V  [CAP_SMD_Size_E]
C59  CAP-NON-POLAR  [CAP-0805]  (value not drawn)
C60  100uF_50V  [CAP_SMD_Size_E]
C61  CAP-POLAR  [CAP-TAN-D]  (value not drawn)
C62  CAP-NON-POLAR  [CAP-0805]  (value not drawn)
C63  CAP-POLAR  [CAP-TAN-D]  (value not drawn)
C64  CAP-NON-POLAR  [CAP-0805]  (value not drawn)
C65  CAP-NON-POLAR  [CAP-0805]  (value not drawn)
C66  CAP-NON-POLAR  [CAP-0805]  (value not drawn)
C68  CAP-NON-POLAR  [CAP-0805]  (value not drawn)
C69  CAP-NON-POLAR  [CAP-0805]  (value not drawn)
C70  CAP-NON-POLAR  [CAP-0805]  (value not drawn)
C71  100uF_50V  [CAP_SMD_Size_E]
C72  CAP-NON-POLAR  [CAP-0805]  (value not drawn)
C73  100uF_50V  [CAP_SMD_Size_E]
C76  0.1uF  [CAP-0805]
C80  CAP-POLAR  [CAP-TAN-D]  (value not drawn)
C81  330pF  [CAP-0805]
C82  CAP-NON-POLAR  [CAP-0805]  (value not drawn)
C83  CAP-POLAR  [CAP-TAN-D]  (value not drawn)
C84  CAP-NON-POLAR  [CAP-0805]  (value not drawn)
C85  CAP-NON-POLAR  [CAP-0805]  (value not drawn)
C86  CAP-NON-POLAR  [CAP-0805]  (value not drawn)
C87  100uF_50V  [CAP_SMD_Size_E]
C88  100uF_50V  [CAP_SMD_Size_E]
C89  330pF  [CAP-0805]
C90  CAP-POLAR  [CAP-TAN-D]  (value not drawn)
C92  CAP-POLAR  [CAP-TAN-D]  (value not drawn)
C93  CAP-NON-POLAR  [CAP-0805]  (value not drawn)
C94  CAP-NON-POLAR  [CAP-0805]  (value not drawn)
C95  CAP-NON-POLAR  [CAP-0805]  (value not drawn)
C96  CAP-NON-POLAR  [CAP-0805]  (value not drawn)
C97  CAP-NON-POLAR  [CAP-0805]  (value not drawn)
C98  CAP-NON-POLAR  [CAP-0805]  (value not drawn)
C101  CAP-NON-POLAR  [CAP-0805]  (value not drawn)
C102  CAP-NON-POLAR  [CAP-0805]  (value not drawn)
C103  100uF_50V  [CAP_SMD_Size_E]
C104  100uF_50V  [CAP_SMD_Size_E]
C109  CAP-POLAR  [CAP-TAN-D]  (value not drawn)
C110  CAP-POLAR  [CAP-TAN-D]  (value not drawn)
C111  CAP-NON-POLAR  [CAP-0805]  (value not drawn)
C112  CAP-NON-POLAR  [CAP-0805]  (value not drawn)
C113  CAP-NON-POLAR  [CAP-0805]  (value not drawn)
C114  100uF_50V  [CAP_SMD_Size_E]
C115  CAP-NON-POLAR  [CAP-0805]  (value not drawn)
C117  100uF_50V  [CAP_SMD_Size_E]
C118  CAP-POLAR  [CAP-TAN-D]  (value not drawn)
C121  CAP-NON-POLAR  [CAP-0805]  (value not drawn)
C122  CAP-POLAR  [CAP-TAN-D]  (value not drawn)
C123  CAP-NON-POLAR  [CAP-0805]  (value not drawn)
C124  CAP-NON-POLAR  [CAP-0805]  (value not drawn)
C125  CAP-NON-POLAR  [CAP-0805]  (value not drawn)
C126  CAP-NON-POLAR  [CAP-0805]  (value not drawn)
C127  2.2nF  [CAP-0805]
C136  CAP-NON-POLAR  [CAP-0805]  (value not drawn)
C137  100uF_50V  [CAP_SMD_Size_E]
C138  CAP-NON-POLAR  [CAP-0805]  (value not drawn)
C139  100uF_50V  [CAP_SMD_Size_E]
C140  CAP-POLAR  [CAP-TAN-D]  (value not drawn)
C141  CAP-NON-POLAR  [CAP-0805]  (value not drawn)
C142  CAP-POLAR  [CAP-TAN-D]  (value not drawn)
C143  CAP-NON-POLAR  [CAP-0805]  (value not drawn)
C147  CAP-NON-POLAR  [CAP-0805]  (value not drawn)
C148  100uF_50V  [CAP_SMD_Size_E]
C149  CAP-NON-POLAR  [CAP-0805]  (value not drawn)
C150  100uF_50V  [CAP_SMD_Size_E]
C151  CAP-POLAR  [CAP-TAN-D]  (value not drawn)
C152  CAP-NON-POLAR  [CAP-0805]  (value not drawn)
C153  CAP-POLAR  [CAP-TAN-D]  (value not drawn)
C154  CAP-NON-POLAR  [CAP-0805]  (value not drawn)
C155  CAP-NON-POLAR  [CAP-0805]  (value not drawn)
C156  CAP-NON-POLAR  [CAP-0805]  (value not drawn)
C159  CAP-NON-POLAR  [CAP-0805]  (value not drawn)
C162  CAP-NON-POLAR  [CAP-0805]  (value not drawn)
C167  CAP-NON-POLAR  [CAP-0805]  (value not drawn)
C168  100uF_50V  [CAP_SMD_Size_E]
C169  CAP-NON-POLAR  [CAP-0805]  (value not drawn)
C170  100uF_50V  [CAP_SMD_Size_E]
C171  CAP-POLAR  [CAP-TAN-D]  (value not drawn)
C172  CAP-NON-POLAR  [CAP-0805]  (value not drawn)
C173  CAP-POLAR  [CAP-TAN-D]  (value not drawn)
C174  CAP-NON-POLAR  [CAP-0805]  (value not drawn)
D1  151031YS06000  [LED_RED]
D2  151031YS06000  [LED_GREEN]
D3  151031YS06000  [LED_YELLOW]
D4  151031YS06000  [LED_BLUE]
D5  151031YS06000  [LED_GREEN]
D6  151031YS06000  [LED_RED]
D7  151031YS06000  [LED_RED]
D8  LED  [LED_BLUE]
D10  US1G  [US1G_SMA]  (value not drawn)
D11  151031YS06000  [LED_GREEN]
D12  US1G  [US1G_SMA]  (value not drawn)
D13  US1G  [US1G_SMA]  (value not drawn)
D14  US1G  [US1G_SMA]  (value not drawn)
D15  US1G  [US1G_SMA]  (value not drawn)
D16  US1G  [US1G_SMA]  (value not drawn)
D17  US1G  [US1G_SMA]  (value not drawn)
D18  US1G  [US1G_SMA]  (value not drawn)
D19  US1G  [US1G_SMA]  (value not drawn)
D20  US1G  [US1G_SMA]  (value not drawn)
D21  US1G  [US1G_SMA]  (value not drawn)
D22  151031YS06000  [LED_RED]
D23  US1G  [US1G_SMA]  (value not drawn)
D24  US1G  [US1G_SMA]  (value not drawn)
D25  US1G  [US1G_SMA]  (value not drawn)
D26  US1G  [US1G_SMA]  (value not drawn)
D27  US1G  [US1G_SMA]  (value not drawn)
D28  US1G  [US1G_SMA]  (value not drawn)
J8  (no value)  [691101710003]
J9  691101710002  [691101710002]  (value not drawn)
J10  B6B-XH-TW  [B6B-XH-TW]
J11  B6B-XH-TW  [B6B-XH-TW]
J12  B6B-XH-TW  [B6B-XH-TW]
J13  B6B-XH-TW  [B6B-XH-TW]
J14  G(4)  [Klema_PCB_15A]
J15  G  [Klema_PCB_15A]
J16  E(5)  [Klema_PCB_15A]
J17  E  [Klema_PCB_15A]
J19  G(6)  [Klema_PCB_15A]
J20  G  [Klema_PCB_15A]
J21  E(7)  [Klema_PCB_15A]
J22  E  [Klema_PCB_15A]
J23  G  [Klema_PCB_15A]
J24  G  [Klema_PCB_15A]
J25  E  [Klema_PCB_15A]
J26  E  [Klema_PCB_15A]
J28  G  [Klema_PCB_15A]
J29  G  [Klema_PCB_15A]
J30  E  [Klema_PCB_15A]
J31  E  [Klema_PCB_15A]
J32  G  [Klema_PCB_15A]
J34  G  [Klema_PCB_15A]
J35  E  [Klema_PCB_15A]
J36  E  [Klema_PCB_15A]
J37  G  [Klema_PCB_15A]
J38  G  [Klema_PCB_15A]
J39  E  [Klema_PCB_15A]
J40  E  [Klema_PCB_15A]
J42  G  [Klema_PCB_15A]
J43  G  [Klema_PCB_15A]
J44  E  [Klema_PCB_15A]
J45  E  [Klema_PCB_15A]
J46  G  [Klema_PCB_15A]
J47  G  [Klema_PCB_15A]
J48  (no value)  [Sullins_SWR25X-NRTC-S06-ST-BA_MFG]
J49  (no value)  [Sullins_SWR25X-NRTC-S06-ST-BA_MFG]
J50  E  [Klema_PCB_15A]
J51  E  [Klema_PCB_15A]
J52  (no value)  [Sullins_SWR25X-NRTC-S06-ST-BA_MFG]
J53  (no value)  [Sullins_SWR25X-NRTC-S06-ST-BA_MFG]
L3  744776227  [WE-PD2_1054]
L4  744776227  [WE-PD2_1054]
L5  220uH  [WE-PD2_7850]
L6  1000µH, 0.3A  [WE-PD2_7850]  (value not drawn)
L7  1000µH, 0.3A  [WE-PD2_7850]  (value not drawn)
P1  61900311121  [61900311121]
P2  61900311121  [61900311121]
P3  61900311121  [61900311121]
P4  61900311121  [61900311121]  (value not drawn)
P5  61900311121  [61900311121]
P6  61900211121  [61900211121]
P7  61900211121  [61900211121]
P8  62000411622  [62000411622]
P9  61900211121  [61900211121]
P10  61300511121  [61300511121]  (value not drawn)
P11  TSW-104-08-G-S  [SMTC-TSW-104-08-X-S]
P12  61300511121  [61300511121]  (value not drawn)
P13  61900311121  [61900311121]  (value not drawn)
P14  61900311121  [61900311121]  (value not drawn)
P15  61900311121  [61900311121]  (value not drawn)
P16  61900311121  [61900311121]  (value not drawn)
Q1  BC847C  [INF-SOT23_N]
Q2  BC847C  [INF-SOT23_N]
Q3  BC847C  [INF-SOT23_N]
Q4  BC847C  [INF-SOT23_N]
R1  10K  [RES-0805]
R2  10K  [RES-0805]
R3  10K  [RES-0805]
R4  10K  [RES-0805]
R5  10K  [RES-0805]
R6  10K  [RES-0805]
R7  220  [RES-0805]
R8  220  [RES-0805]
R9  220  [RES-0805]
R10  220  [RES-0805]
R11  220  [RES-0805]
R12  220  [RES-0805]
R13  220  [RES-0805]
R22  20K  [RES-0805]
R23  20K  [RES-0805]
R24  10K  [RES-0805]
R25  10K  [RES-0805]
R26  10K  [RES-0805]
R27  10K  [RES-0805]
R28  10K  [RES-0805]
R29  30K  [RES-0805]
R30  30K  [RES-0805]
R32  100  [RES-0805]
R36  100  [RES-0805]
R38  10K  [RES-0805]
R39  220  [RES-0805]
R40  10K  [RES-0805]
R41  10K  [RES-0805]
R49  10K  [RES-0805]
R50  1K  [RES-0805]
R51  10K  [RES-0805]
R52  47K  [RES-0805]
R53  10K  [RES-0805]
R54  0.33  [RES-2512]
R55  220  [RES-0805]
R56  3.8K  [RES-0805]
R57  1.2K  [RES-0805]
R58  10K  [RES-0805]
R59  10K  [RES-0805]
R60  10  [RES-2512]
R61  10K  [RES-0805]
R62  1K  [RES-2512]
R63  10  [RES-2512]
R64  10K  [RES-0805]
R65  1K  [RES-2512]
R66  10K  [RES-0805]
R67  10K  [RES-0805]
R68  10K  [RES-0805]
R69  10K  [RES-0805]
R70  10K  [RES-0805]
R71  10K  [RES-0805]
R72  100K  [RES-0805]
R73  10K  [RES-0805]
R74  100K  [RES-0805]
R75  10K  [RES-0805]
R76  3K  [RES-0805]
R77  10  [RES-2512]
R78  10K  [RES-0805]
R81  10K  [RES-0805]
R82  1K  [RES-2512]
R83  10  [RES-2512]
R84  1K  [RES-0805]
R86  10K  [RES-0805]
R87  1K  [RES-2512]
R88  10K  [RES-0805]
R89  47K  [RES-0805]
R90  10K  [RES-0805]
R91  10  [RES-2512]
R92  10  [RES-2512]
R93  10K  [RES-0805]
R94  1K  [RES-2512]
R95  10K  [RES-0805]
R96  1K  [RES-2512]
R97  10K  [RES-0805]
R98  10K  [RES-0805]
R99  10K  [RES-0805]
R100  10K  [RES-0805]
R101  10K  [RES-0805]
R102  10K  [RES-0805]
R103  47K  [RES-0805]
R104  3K  [RES-0805]
R105  100K  [RES-0805]
R106  10K  [RES-0805]
R107  100K  [RES-0805]
R108  10K  [RES-0805]
R111  1K  [RES-0805]
R113  10K  [RES-0805]
R114  10  [RES-2512]
R115  10  [RES-2512]
R116  10K  [RES-0805]
R117  1K  [RES-2512]
R118  10K  [RES-0805]
R119  1K  [RES-2512]
R120  10K  [RES-0805]
R121  10K  [RES-0805]
R122  10E  [RES-0805]
R123  10E  [RES-0805]
R124  10  [RES-2512]
R125  10K  [RES-0805]
R126  10K  [RES-0805]
R127  10K  [RES-0805]
R128  10K  [RES-0805]
R129  10K  [RES-0805]
R130  10K  [RES-0805]
R131  10  [RES-2512]
R132  3K  [RES-0805]
R133  10K  [RES-0805]
R134  1K  [RES-2512]
R135  10K  [RES-0805]
R136  1K  [RES-2512]
R137  10K  [RES-0805]
R140  1K  [RES-0805]
R142  220  [RES-0805]
R143  10K  [RES-0805]
R144  100K  [RES-0805]
R145  10K  [RES-0805]
R146  100K  [RES-0805]
R147  10K  [RES-0805]
R148  10  [RES-2512]
R149  10  [RES-2512]
R150  10K  [RES-0805]
R151  1K  [RES-2512]
R152  10K  [RES-0805]
R153  1K  [RES-2512]
R154  3K  [RES-0805]
R157  1K  [RES-0805]
R159  10K  [RES-0805]
R160  10  [RES-2512]
R161  10K  [RES-0805]
R162  10K  [RES-0805]
R163  10K  [RES-0805]
R164  10K  [RES-0805]
R165  10K  [RES-0805]
R166  10K  [RES-0805]
R167  10  [RES-2512]
R168  10K  [RES-0805]
R169  1K  [RES-2512]
R170  10K  [RES-0805]
R171  1K  [RES-2512]
R172  100K  [RES-0805]
R173  10K  [RES-0805]
R174  100K*  [RES-0805]
R175  10K  [RES-0805]
R176  10  [RES-2512]
R177  10  [RES-2512]
R178  10K  [RES-0805]
R179  1K  [RES-2512]
R180  10K  [RES-0805]
R181  1K  [RES-2512]
TP1  (no value)  [Test_Point]
TP2  (no value)  [Test_Point]
TP3  (no value)  [Test_Point]
TP5  Test_Point_PCB  [Test_Point]  (value not drawn)
TP6  (no value)  [Test_Point]
TP7  (no value)  [Test_Point]
TP8  (no value)  [Test_Point]
TP9  Test_Point_PCB  [Test_Point]  (value not drawn)
TP10  Test_Point_PCB  [Test_Point]  (value not drawn)
TP11  Test_Point_PCB  [Test_Point]  (value not drawn)
TP13  Test_Point_PCB  [Test_Point]  (value not drawn)
TP14  Test_Point_PCB  [Test_Point]  (value not drawn)
TP16  (no value)  [Test_Point]
TP20  Test_Point_PCB  [Test_Point]  (value not drawn)
TP21  Test_Point_PCB  [Test_Point]  (value not drawn)
TP22  Test_Point_PCB  [Test_Point]  (value not drawn)
TP23  Test_Point_PCB  [Test_Point]  (value not drawn)
TP24  Test_Point_PCB  [Test_Point]  (value not drawn)
TP25  Test_Point_PCB  [Test_Point]  (value not drawn)
TP26  Test_Point_PCB  [Test_Point]  (value not drawn)
TP28  Test_Point_PCB  [Test_Point]  (value not drawn)
TP29  Test_Point_PCB  [Test_Point]  (value not drawn)
TP30  Test_Point_PCB  [Test_Point]  (value not drawn)
TP32  Test_Point_PCB  [Test_Point]  (value not drawn)
TP33  Test_Point_PCB  [Test_Point]  (value not drawn)
TP34  Test_Point_PCB  [Pin_Test_Point(Orange)]  (value not drawn)
TP35  Test_Point_PCB  [Test_Point]  (value not drawn)
TP36  Test_Point_PCB  [Test_Point]  (value not drawn)
TP37  Test_Point_PCB  [Test_Point]  (value not drawn)
TP38  Test_Point_PCB  [Test_Point]  (value not drawn)
TP39  Test_Point_PCB  [Test_Point]  (value not drawn)
TP40  Test_Point_PCB  [Test_Point]  (value not drawn)
TP41  Test_Point_PCB  [Test_Point]  (value not drawn)
TP42  Test_Point_PCB  [Test_Point]  (value not drawn)
TP43  Test_Point_PCB  [Test_Point]  (value not drawn)
TP44  Test_Point_PCB  [Test_Point]  (value not drawn)
TP45  Test_Point_PCB  [Test_Point]  (value not drawn)
TP49  Test_Point_PCB  [Test_Point]  (value not drawn)
TP50  (no value)  [Test_Point]
TP51  Test_Point_PCB  [Test_Point]  (value not drawn)
TP52  Test_Point_PCB  [Test_Point]  (value not drawn)
TP53  Test_Point_PCB  [Test_Point]  (value not drawn)
TP54  Test_Point_PCB  [Test_Point]  (value not drawn)
TP55  Test_Point_PCB  [Test_Point]  (value not drawn)
TP56  Test_Point_PCB  [Test_Point]  (value not drawn)
TP57  Test_Point_PCB  [Test_Point]  (value not drawn)
TP58  Test_Point_PCB  [Test_Point]  (value not drawn)
TP59  Test_Point_PCB  [Test_Point]  (value not drawn)
TP60  Test_Point_PCB  [Test_Point]  (value not drawn)
TP61  (no value)  [Test_Point]
TP62  Test_Point_PCB  [Test_Point]  (value not drawn)
TP63  Test_Point_PCB  [Test_Point]  (value not drawn)
TP67  Test_Point_PCB  [Test_Point]  (value not drawn)
TP68  Test_Point_PCB  [Test_Point]  (value not drawn)
TP69  Test_Point_PCB  [Test_Point]  (value not drawn)
TP70  Test_Point_PCB  [Test_Point]  (value not drawn)
TP71  Test_Point_PCB  [Test_Point]  (value not drawn)
TP72  Test_Point_PCB  [Test_Point]  (value not drawn)
TP73  Test_Point_PCB  [Test_Point]  (value not drawn)
TP74  Test_Point_PCB  [Test_Point]  (value not drawn)
TP75  Test_Point_PCB  [Test_Point]  (value not drawn)
TP76  Test_Point_PCB  [Test_Point]  (value not drawn)
TP77  Test_Point_PCB  [Test_Point]  (value not drawn)
TP78  Test_Point_PCB  [Test_Point]  (value not drawn)
TP79  Test_Point_PCB  [Test_Point]  (value not drawn)
TP83  Test_Point_PCB  [Test_Point]  (value not drawn)
TP84  Test_Point_PCB  [Test_Point]  (value not drawn)
TP85  Test_Point_PCB  [Test_Point]  (value not drawn)
TP86  Test_Point_PCB  [Test_Point]  (value not drawn)
TP87  Test_Point_PCB  [Test_Point]  (value not drawn)
TP88  Test_Point_PCB  [Test_Point]  (value not drawn)
TP89  Test_Point_PCB  [Test_Point]  (value not drawn)
TP93  Test_Point_PCB  [Test_Point]  (value not drawn)
TP94  Test_Point_PCB  [Test_Point]  (value not drawn)
TP95  Test_Point_PCB  [Test_Point]  (value not drawn)
TP96  Test_Point_PCB  [Test_Point]  (value not drawn)
TP97  Test_Point_PCB  [Test_Point]  (value not drawn)
TP98  Test_Point_PCB  [Test_Point]  (value not drawn)
TP99  Test_Point_PCB  [Test_Point]  (value not drawn)
TP100  Test_Point_PCB  [Test_Point]  (value not drawn)
TP101  Test_Point_PCB  [Test_Point]  (value not drawn)
TP102  Test_Point_PCB  [Test_Point]  (value not drawn)
TP103  Test_Point_PCB  [Test_Point]  (value not drawn)
TP104  Test_Point_PCB  [Test_Point]  (value not drawn)
TP105  Test_Point_PCB  [Test_Point]  (value not drawn)
U1  DC-DC  [DC-DC_Bridge]
U2  B0505S-1W  [B0505S-1W]
U3  MAX485  [SOIC-8-MFG]
U4  ADUM1401BRWZ  [ADI-RW-16_M]
U5  (no value)  [SOT-23-5]
U6  DC-DC  [DC-DC_Bridge]
U7  MC34063  [SOIC-8_M]
U8  DC-DC  [DC-DC_Bridge]
U9  AMS1117-3v3  [SOT-223-3]
U10  DC-DC  [DC-DC_Bridge]
U11  AMS1117-3v3  [SOT-223-3]
U12  STM32F303RBT6  [LQFP64-10x10mm]
U13  UCC21520DW  [FP-DW0016B-MFG]
U14  UCC21520DW  [FP-DW0016B-MFG]
U15  74LVC1G14  [SOT23-5_N]  (value not drawn)  (parts A,B of 2)
U16  74LVC1G14  [SOT23-5_N]  (value not drawn)  (parts A,B of 2)
U17  74LVC1G14  [SOT23-5_N]  (value not drawn)  (parts A,B of 2)
U18  74LVC1G14  [SOT23-5_N]  (value not drawn)  (parts A,B of 2)
U20  UCC21520DW  [FP-DW0016B-MFG]
U21  UCC21520DW  [FP-DW0016B-MFG]
U22  74LVC1G14  [SOT23-5_N]  (value not drawn)  (parts A,B of 2)
U23  74LVC1G14  [SOT23-5_N]  (value not drawn)  (parts A,B of 2)
U24  74LVC1G14  [SOT23-5_N]  (value not drawn)  (parts A,B of 2)
U25  74LVC1G14  [SOT23-5_N]  (value not drawn)  (parts A,B of 2)
U27  74LVC1G14  [SOT23-5_N]  (value not drawn)  (parts A,B of 2)
U28  74LVC1G14  [SOT23-5_N]  (value not drawn)  (parts A,B of 2)
U29  74LVC1G14  [SOT23-5_N]  (value not drawn)  (parts A,B of 2)
U30  74LVC1G14  [SOT23-5_N]  (value not drawn)  (parts A,B of 2)
U31  UCC21520DW  [FP-DW0016B-MFG]
U32  UCC21520DW  [FP-DW0016B-MFG]
U35  74LVC1G14  [SOT23-5_N]  (value not drawn)  (parts A,B of 2)
U36  74LVC1G14  [SOT23-5_N]  (value not drawn)  (parts A,B of 2)
U37  74LVC1G14  [SOT23-5_N]  (value not drawn)  (parts A,B of 2)
U38  74LVC1G14  [SOT23-5_N]  (value not drawn)  (parts A,B of 2)
U39  UCC21520DW  [FP-DW0016B-MFG]
U40  UCC21520DW  [FP-DW0016B-MFG]
U41  DC-DC  [DC-DC_Bridge]
U42  DC-DC  [DC-DC_Bridge]
VD1  SMF3.3A  [SMF3.3A]
VD2  SMBJ18CA  [DO-214AA]
VD3  SMBJ18CA  [DO-214AA]
VD4  5.1V  [DO-35]
VD5  5.1V  [DO-35]
VD6  SMBJ18CA  [DO-214AA]
VD7  SMBJ18CA  [DO-214AA]
VD8  5.1V  [DO-35]
VD9  5.1V  [DO-35]
VD10  SMBJ18CA  [DO-214AA]
VD11  SMBJ18CA  [DO-214AA]
VD12  5.1V  [DO-35]
VD13  5.1V  [DO-35]
VD14  SMBJ18CA  [DO-214AA]
VD15  SMBJ18CA  [DO-214AA]
VD16  5.1V  [DO-35]
VD17  5.1V  [DO-35]
VD18  SMF3.3A  [SMF3.3A]
VD20  SMBJ18CA  [DO-214AA]
VD21  SMBJ18CA  [DO-214AA]
VD22  5.1V  [DO-35]
VD23  5.1V  [DO-35]
VD24  SMBJ18CA  [DO-214AA]
VD25  SMBJ18CA  [DO-214AA]
VD26  5.1V  [DO-35]
VD27  5.1V  [DO-35]
VD28  SMBJ18CA  [DO-214AA]
VD29  SMBJ18CA  [DO-214AA]
VD30  5.1V  [DO-35]
VD31  5.1V  [DO-35]
VD32  SMBJ18CA  [DO-214AA]
VD33  SMBJ18CA  [DO-214AA]
VD34  5.1V  [DO-35]
VD35  5.1V  [DO-35]
X1  CONN-4-PIN  [CONN-PLS-4-2.54mm]  (value not drawn)
Y1  FOXSLF/120-20  [FOX-FOXSLF-2_V]
ZD1  P6SMB16CA  [DO-214AA]  (value not drawn)
ZD2  P6SMB16CA  [DO-214AA]  (value not drawn)

### Ports
ADC_1, ADC_2, ADC_3, ADC_4, BOOT (bidir), CS_1, CS_2, CS_3, DC/RS, DIRECT, DIRECT (bidir), DISP_INT, DISP_LED, DISP_RST, HALL_A, HALL_B, HALL_C, LED_1, LED_2, LED_3, LED_4, LED_5, LED_6, LED_7, MISO, MOSI, OUT_N1, OUT_P1, PORT_1, PORT_1_DIS, PORT_2, PORT_2_DIS, PORT_3, PORT_3_DIS, PORT_4, PORT_4_DIS, PWM_1_1, PWM_1_1_INV, PWM_1_1_STR, PWM_1_2, PWM_1_2_INV, PWM_1_2_STR, PWM_2_1, PWM_2_1_INV, PWM_2_1_STR, PWM_2_2, PWM_2_2_INV, PWM_2_2_STR, PWM_3_1, PWM_3_1_INV, PWM_3_1_STR, PWM_3_2, PWM_3_2_INV, PWM_3_2_STR, PWM_4_1, PWM_4_1_INV, PWM_4_1_STR, PWM_4_2, PWM_4_2_INV, PWM_4_2_STR, RESET (bidir), RX, RX (bidir), SCK, SCL, SDA, SENS_1, SENS_2, SENS_3, SENS_4, SWCLC (bidir), SWDIO (bidir), TIME_in_1, TIME_in_2, TX, TX (bidir), UI_INT

### Nets
+3V3: C51.1(+) C52.2 J48.1 J49.1 J52.1 J53.1 L7.2 P10.4 P11.1 R25.2 R28.2 R78.2 R90.2 R120.2 R121.2 R137.1 R142.2 TP6.1(G9) U4.1(VDD1) U4.7(VE1)
+3V3_MCU: C21.1 C22.1 C23.1 C24.1 C30.1 C43.1(+) C46.2 L6.1 R58.2 TP33.1(G9) U9.2(VOUT) U12.1(VBAT) U12.19(VDD) U12.32(VDD) U12.48(VDD) U12.64(VDD)
+3V3_REF: C20.2 C44.1(+) C45.2 L6.2 R55.2 TP32.1(G9) U12.13(VDDA/VREF+)
+5: C4.2 C5.2 C6.2 C7.2 C8.2 C10.2 C11.2 C12.2 C13.2 C14.2 C15.2 C16.2 C17.2 C18.2 C19.2 C39.1(+) C40.2 C42.2 C49.1(+) C54.2 C76.2 L3.1 L4.2 R76.1 R104.1 R132.1 R154.1 TP29.1(G9) U9.3(VIN) U11.3(VIN) U13.3(VCCI) U13.8(VCCI) U14.3(VCCI) U14.8(VCCI) U15.1(NC) U15.5(VCC) U16.1(NC) U16.5(VCC) U17.1(NC) U17.5(VCC) U18.1(NC) U18.5(VCC) U20.3(VCCI) U20.8(VCCI) U21.3(VCCI) U21.8(VCCI) U22.1(NC) U22.5(VCC) U23.1(NC) U23.5(VCC) U24.1(NC) U24.5(VCC) U25.1(NC) U25.5(VCC) U27.1(NC) U27.5(VCC) U28.1(NC) U28.5(VCC) U29.1(NC) U29.5(VCC) U30.1(NC) U30.5(VCC) U31.3(VCCI) U31.8(VCCI) U32.3(VCCI) U32.8(VCCI) U35.1(NC) U35.5(VCC) U36.1(NC) U36.5(VCC) U37.1(NC) U37.5(VCC) U38.1(NC) U38.5(VCC) U39.3(VCCI) U39.8(VCCI) U40.3(VCCI) U40.8(VCCI)
+5V_1: C25.2 C38.1(+) J10.6 J11.6 J12.6 J13.6 J48.2 J53.2 L4.1 L5.2 P1.3 P2.3 P3.3 P4.3 P5.3 P8.1 P10.5 P12.5 P13.1 P14.1 P15.1 P16.1 R56.1 TP30.1(G9) U5.5(VDD) X1.1
+5V_ISO: C9.1 R24.2 R26.2 R27.2 TP5.1(G9) U2.4(+Vo) U3.8(VCC) U4.10(VE2) U4.16(VDD2)
+5V_RS: C33.1(+) C34.2 L3.2 U2.2(VIN)
+24V_1: C57.2 C58.1(+) R62.2 U10.1(+18V_1) U10.2(+18V_1) U13.16(VDDA)
+24V_2: C70.2 C71.1(+) C72.2 C73.1(+) C101.2 C102.2 C103.1(+) C104.1(+) C136.2 C137.1(+) C138.2 C139.1(+) C167.2 C168.1(+) C169.2 C170.1(+) R82.2 R87.2 R117.2 R119.2 R151.2 R153.2 R179.2 R181.2 U6.17(+18V_2) U6.18(+18V_2) U8.1(+18V_1) U8.2(+18V_1) U8.17(+18V_2) U8.18(+18V_2) U10.17(+18V_2) U10.18(+18V_2) U13.11(VDDB) U14.11(VDDB) U20.11(VDDB) U21.11(VDDB) U31.11(VDDB) U32.11(VDDB) U39.11(VDDB) U40.11(VDDB)
+24V_3: C86.2 C88.1(+) R96.2 U6.1(+18V_1) U6.2(+18V_1) U21.16(VDDA)
+24V_4: C115.2 C117.1(+) R136.2 U32.16(VDDA) U42.1(+18V_1) U42.2(+18V_1)
+24V_5: C149.2 C150.1(+) R171.2 U40.16(VDDA) U42.17(+18V_2) U42.18(+18V_2)
+24V_6: C59.2 C60.1(+) R65.2 U14.16(VDDA) U41.1(+18V_1) U41.2(+18V_1)
+24V_7: C85.2 C87.1(+) R94.2 U20.16(VDDA) U41.17(+18V_2) U41.18(+18V_2)
+24V_8: C113.2 C114.1(+) R134.2 U1.1(+18V_1) U1.2(+18V_1) U31.16(VDDA)
+24V_9: C147.2 C148.1(+) R169.2 U1.17(+18V_2) U1.18(+18V_2) U39.16(VDDA)
GND: C1.1 C2.1 C3.1 C4.1 C5.1 C6.1 C7.1 C8.1 C10.1 C11.1 C12.1 C13.1 C14.1 C15.1 C16.1 C17.1 C18.1 C19.1 C20.1 C21.2 C22.2 C23.2 C24.2 C25.1 C28.1 C30.2 C33.2(-) C34.1 C36.2 C38.2(-) C39.2(-) C40.1 C41.2 C42.1 C43.2(-) C44.2(-) C45.1 C46.1 C47.2(-) C48.1 C49.2(-) C50.2(-) C51.2(-) C52.1 C53.1 C54.1 C55.2 C56.2 C64.1 C65.1 C68.1 C69.1 C76.1 C81.1 C89.1 C95.1 C96.1 C97.1 C98.1 C124.1 C125.1 C126.1 C127.1 C155.1 C156.1 C159.1 C162.1 D1.2(K) D2.2(K) D3.2(K) D4.2(K) D5.2(K) D6.2(K) D7.2(K) D8.2(K) D10.2(A) D11.2(K) J9.1 J10.1 J11.1 J12.1 J13.1 J48.6 J49.6 J52.6 J53.6 P1.1 P2.1 P3.1 P4.1 P5.1 P6.1 P7.1 P8.4 P9.2 P10.1 P11.4 P12.1 P13.3 P14.3 P15.3 P16.3 Q1.2(E) Q2.2(E) Q3.2(E) Q4.2(E) R4.2 R5.2 R6.2 R29.1 R30.1 R40.1 R52.2 R57.1 R59.1 R66.1 R67.1 R68.1 R69.1 R70.1 R71.1 R72.1 R73.1 R74.1 R75.1 R88.2 R89.2 R97.1 R98.1 R99.1 R100.1 R101.1 R102.1 R103.2 R105.1 R106.1 R107.1 R108.1 R113.2 R125.1 R126.1 R127.1 R128.1 R129.1 R130.1 R143.2 R144.1 R145.1 R146.1 R147.1 R159.2 R161.1 R162.1 R163.1 R164.1 R165.1 R166.1 R172.1 R173.1 R174.1 R175.1 TP34.1(G9) U1.10(GND) U1.11(GND) U2.1(GND) U4.2(GND1) U4.8(GND1) U5.2(VSS) U6.10(GND) U6.11(GND) U7.4(GND) U8.10(GND) U8.11(GND) U9.1(Ground) U10.10(GND) U10.11(GND) U11.1(Ground) U12.12(VSSA/VREF-) U12.31(VSS) U12.47(VSS) U12.63(VSS) U13.4(GND) U14.4(GND) U15.3(GND) U16.3(GND) U17.3(GND) U18.3(GND) U20.4(GND) U21.4(GND) U22.3(GND) U23.3(GND) U24.3(GND) U25.3(GND) U27.3(GND) U28.3(GND) U29.3(GND) U30.3(GND) U31.4(GND) U32.4(GND) U35.3(GND) U36.3(GND) U37.3(GND) U38.3(GND) U39.4(GND) U40.4(GND) U41.10(GND) U41.11(GND) U42.10(GND) U42.11(GND) VD1.2(A) VD18.2(A) X1.4
GND_2: C9.2 J8.2 R38.1 R41.1 TP20.1(G9) U2.3(0V) U3.5(GND) U4.9(GND2) U4.15(GND2) ZD1.2(A) ZD2.2(A)
GND_-24V_1: C57.1 C58.2(-) C61.2(-) C62.1 U10.3(-18V_1) U10.4(-18V_1) U13.14(VSSA) VD4.2(A)
GND_-24V_2: C70.1 C71.2(-) C72.1 C73.2(-) C80.2(-) C82.1 C83.2(-) C84.1 C101.1 C102.1 C103.2(-) C104.2(-) C109.2(-) C110.2(-) C111.1 C112.1 C136.1 C137.2(-) C138.1 C139.2(-) C140.2(-) C141.1 C142.2(-) C143.1 C167.1 C168.2(-) C169.1 C170.2(-) C171.2(-) C172.1 C173.2(-) C174.1 U6.15(-18V_2) U6.16(-18V_2) U8.3(-18V_1) U8.4(-18V_1) U8.15(-18V_2) U8.16(-18V_2) U10.15(-18V_2) U10.16(-18V_2) U13.9(VSSB) U14.9(VSSB) U20.9(VSSB) U21.9(VSSB) U31.9(VSSB) U32.9(VSSB) U39.9(VSSB) U40.9(VSSB) VD8.2(A) VD9.2(A) VD16.2(A) VD17.2(A) VD26.2(A) VD27.2(A) VD34.2(A) VD35.2(A)
GND_-24V_3: C86.1 C88.2(-) C92.2(-) C94.1 U6.3(-18V_1) U6.4(-18V_1) U21.14(VSSA) VD13.2(A)
GND_-24V_4: C115.1 C117.2(-) C122.2(-) C123.1 U32.14(VSSA) U42.3(-18V_1) U42.4(-18V_1) VD23.2(A)
GND_-24V_5: C149.1 C150.2(-) C153.2(-) C154.1 U40.14(VSSA) U42.15(-18V_2) U42.16(-18V_2) VD31.2(A)
GND_-24V_6: C59.1 C60.2(-) C63.2(-) C66.1 U14.14(VSSA) U41.3(-18V_1) U41.4(-18V_1) VD5.2(A)
GND_-24V_7: C85.1 C87.2(-) C90.2(-) C93.1 U20.14(VSSA) U41.15(-18V_2) U41.16(-18V_2) VD12.2(A)
GND_-24V_8: C113.1 C114.2(-) C118.2(-) C121.1 U1.3(-18V_1) U1.4(-18V_1) U31.14(VSSA) VD22.2(A)
GND_-24V_9: C147.1 C148.2(-) C151.2(-) C152.1 U1.15(-18V_2) U1.16(-18V_2) U39.14(VSSA) VD30.2(A)
VCC: C41.1 C47.1(+) J9.2 R54.1 U1.8(+12V) U1.9(+12V) U6.8(+12V) U6.9(+12V) U7.6(VCC) U8.8(+12V) U8.9(+12V) U10.8(+12V) U10.9(+12V) U41.8(+12V) U41.9(+12V) U42.8(+12V) U42.9(+12V)
NetC1_2: C1.2 R1.2 R4.1 TP1.1(G9) U12.23(PA7) ; port HALL_C
NetC2_2: C2.2 R2.2 R5.1 TP2.1(G9) U12.22(PA6) ; port HALL_B
NetC3_2: C3.2 R3.2 R6.1 TP3.1(G9) U12.21(PA5) ; port HALL_A
NetC26_1: C26.1 R51.1 TP26.1(G9) X1.2 ; port OUT_N1
NetC26_2: C26.2 R49.1 TP22.1(G9) X1.3 ; port OUT_P1
NetC27_1: C27.1 C29.1 R51.2 R53.1 TP25.1(G9) U5.4(VIN-)
NetC27_2: C27.2 R49.2 TP21.1(G9) U5.3(VIN+)
NetC28_2: C28.2 R50.1 R52.1 TP24.1(G9) U12.8(PC0) ; port ADC_2
NetC29_2: C29.2 R50.2 R53.2 TP23.1(G9) U5.1(VOUT)
NetC36_1: C36.1 U7.3(TC)
NetC48_2: C48.2 R58.1 U12.7(NRST) ; port RESET
NetC50_1: C50.1(+) C53.2 L7.1 U11.2(VOUT)
NetC55_1: C55.1 U12.5(PF0/OSC_IN) Y1.2
NetC56_1: C56.1 U12.6(PF1/OSC_OUT) Y1.1
NetC61_1: C61.1(+) C62.2 J16.1 R61.1 R62.1 TP39.1(G9) VD2.1(C) VD4.1(C)
NetC63_1: C63.1(+) C66.2 J17.1 R64.1 R65.1 TP44.1(G9) VD3.1(C) VD5.1(C)
NetC64_2: C64.2 C97.2 Q1.3(C) R73.2 R76.2 R108.2 U13.5(DISABLE) U21.5(DISABLE) ; port PORT_1_DIS
NetC65_2: C65.2 R72.2 U13.6(DT)
NetC68_2: C68.2 C95.2 Q3.3(C) R75.2 R106.2 R132.2 U14.5(DISABLE) U20.5(DISABLE) ; port PORT_3_DIS
NetC69_2: C69.2 R74.2 U14.6(DT)
NetC80_1: C80.1(+) C82.2 J21.1 R81.1 R82.1 TP51.1(G9) VD6.1(C) VD8.1(C)
NetC81_2: C81.2 P6.2 R78.1 R89.1 TP50.1(G9) U12.9(PC1) ; port ADC_3
NetC83_1: C83.1(+) C84.2 J22.1 R86.1 R87.1 TP52.1(G9) VD7.1(C) VD9.1(C)
NetC89_2: C89.2 P7.2 R90.1 R103.1 TP61.1(G9) U12.10(PC2) ; port ADC_4
NetC90_1: C90.1(+) C93.2 J25.1 R93.1 R94.1 TP62.1(G9) VD10.1(C) VD12.1(C)
NetC92_1: C92.1(+) C94.2 J26.1 R95.1 R96.1 TP63.1(G9) VD11.1(C) VD13.1(C)
NetC96_2: C96.2 R105.2 U20.6(DT)
NetC98_2: C98.2 R107.2 U21.6(DT)
NetC109_1: C109.1(+) C111.2 J30.1 R116.1 R117.1 TP69.1(G9) VD14.1(C) VD16.1(C)
NetC110_1: C110.1(+) C112.2 J31.1 R118.1 R119.1 TP70.1(G9) VD15.1(C) VD17.1(C)
NetC118_1: C118.1(+) C121.2 J35.1 R133.1 R134.1 TP79.1(G9) VD20.1(C) VD22.1(C)
NetC122_1: C122.1(+) C123.2 J36.1 R135.1 R136.1 TP83.1(G9) VD21.1(C) VD23.1(C)
NetC124_2: C124.2 C155.2 Q4.3(C) R145.2 R154.2 R173.2 U31.5(DISABLE) U39.5(DISABLE) ; port PORT_4_DIS
NetC125_2: C125.2 R144.2 U31.6(DT)
NetC126_2: C126.2 C159.2 Q2.3(C) R104.2 R147.2 R175.2 U32.5(DISABLE) U40.5(DISABLE) ; port PORT_2_DIS
NetC127_2: C127.2 R146.2 U32.6(DT)
NetC140_1: C140.1(+) C141.2 J39.1 R150.1 R151.1 TP87.1(G9) VD24.1(C) VD26.1(C)
NetC142_1: C142.1(+) C143.2 J40.1 R152.1 R153.1 TP88.1(G9) VD25.1(C) VD27.1(C)
NetC151_1: C151.1(+) C152.2 J44.1 R168.1 R169.1 TP100.1(G9) VD28.1(C) VD30.1(C)
NetC153_1: C153.1(+) C154.2 J45.1 R170.1 R171.1 TP101.1(G9) VD29.1(C) VD31.1(C)
NetC156_2: C156.2 R172.2 U39.6(DT)
NetC162_2: C162.2 R174.2 U40.6(DT)
NetC171_1: C171.1(+) C172.2 J50.1 R178.1 R179.1 TP104.1(G9) VD32.1(C) VD34.1(C)
NetC173_1: C173.1(+) C174.2 J51.1 R180.1 R181.1 TP105.1(G9) VD33.1(C) VD35.1(C)
NetD1_1: D1.1(A) R7.1
NetD2_1: D2.1(A) R8.1
NetD3_1: D3.1(A) R9.1
NetD4_1: D4.1(A) R10.1
NetD5_1: D5.1(A) R11.1
NetD6_1: D6.1(A) R12.1
NetD7_1: D7.1(A) R13.1
NetD8_1: D8.1(A) R39.1
NetD10_1: D10.1(C) L5.1 TP28.1(G9) U7.2(SWE)
NetD11_1: D11.1(A) R55.1
NetD12_1: D12.1(C) R60.1 U13.15(OUTA)
NetD12_2: D12.2(A) J14.1 R60.2 R61.2 TP35.1(G9) VD2.2(A)
NetD13_1: D13.1(C) R63.1 U14.15(OUTA)
NetD13_2: D13.2(A) J15.1 R63.2 R64.2 TP36.1(G9) VD3.2(A)
NetD14_1: D14.1(C) R77.1 U13.10(OUTB)
NetD14_2: D14.2(A) J19.1 R77.2 R81.2 TP45.1(G9) VD6.2(A)
NetD15_1: D15.1(C) R83.1 U14.10(OUTB)
NetD15_2: D15.2(A) J20.1 R83.2 R86.2 TP49.1(G9) VD7.2(A)
NetD16_1: D16.1(C) R91.1 U20.15(OUTA)
NetD16_2: D16.2(A) J23.1 R91.2 R93.2 TP56.1(G9) VD10.2(A)
NetD17_1: D17.1(C) R92.1 U21.15(OUTA)
NetD17_2: D17.2(A) J24.1 R92.2 R95.2 TP55.1(G9) VD11.2(A)
NetD18_1: D18.1(C) R114.1 U20.10(OUTB)
NetD18_2: D18.2(A) J28.1 R114.2 R116.2 TP67.1(G9) VD14.2(A)
NetD19_1: D19.1(C) R115.1 U21.10(OUTB)
NetD19_2: D19.2(A) J29.1 R115.2 R118.2 TP68.1(G9) VD15.2(A)
NetD20_1: D20.1(C) R124.1 U31.15(OUTA)
NetD20_2: D20.2(A) J32.1 R124.2 R133.2 TP77.1(G9) VD20.2(A)
NetD21_1: D21.1(C) R131.1 U32.15(OUTA)
NetD21_2: D21.2(A) J34.1 R131.2 R135.2 TP78.1(G9) VD21.2(A)
NetD22_1: D22.1(A) R142.1
NetD22_2: D22.2(K) P9.1 R137.2 TP84.1(G9) U12.24(PC4) ; port UI_INT
NetD23_1: D23.1(C) R148.1 U31.10(OUTB)
NetD23_2: D23.2(A) J37.1 R148.2 R150.2 TP85.1(G9) VD24.2(A)
NetD24_1: D24.1(C) R149.1 U32.10(OUTB)
NetD24_2: D24.2(A) J38.1 R149.2 R152.2 TP86.1(G9) VD25.2(A)
NetD25_1: D25.1(C) R160.1 U39.15(OUTA)
NetD25_2: D25.2(A) J42.1 R160.2 R168.2 TP98.1(G9) VD28.2(A)
NetD26_1: D26.1(C) R167.1 U40.15(OUTA)
NetD26_2: D26.2(A) J43.1 R167.2 R170.2 TP99.1(G9) VD29.2(A)
NetD27_1: D27.1(C) R176.1 U39.10(OUTB)
NetD27_2: D27.2(A) J46.1 R176.2 R178.2 TP102.1(G9) VD32.2(A)
NetD28_1: D28.1(C) R177.1 U40.10(OUTB)
NetD28_2: D28.2(A) J47.1 R177.2 R180.2 TP103.1(G9) VD33.2(A)
NetJ8_1: J8.1 R41.2 U3.7(B) ZD2.1(A)
NetJ8_3: J8.3 R24.1 U3.6(A) ZD1.1(A)
NetJ10_2: J10.2 J11.2 J13.2 U12.57(PB5) ; port MOSI
NetJ10_3: J10.3 J11.3 J13.3 U12.56(PB4) ; port MISO
NetJ10_4: J10.4 J11.4 J13.4 U12.55(PB3) ; port SCK
NetJ10_5: J10.5 U12.27(PB1) ; port CS_2
NetJ11_5: J11.5 U12.28(PB2) ; port CS_3
NetJ12_2: J12.2 U12.40(PC9) ; port DC/RS
NetJ12_3: J12.3 U12.38(PC7) ; port DISP_RST
NetJ12_4: J12.4 U12.39(PC8) ; port DISP_LED
NetJ12_5: J12.5 U12.11(PC3) ; port DISP_INT
NetJ13_5: J13.5 U12.26(PB0) ; port CS_1
NetJ48_3: J48.3 J52.5 R25.1 TP14.1(G9) U4.6(VOD) U12.59(PB7) ; port RX
NetJ48_4: J48.4 J52.4 R28.1 TP11.1(G9) U4.4(VIB) U12.58(PB6) ; port TX
NetJ48_5: J48.5 R39.2 R40.2 TP10.1(G9) U4.5(VIC) U12.54(PD2) ; port DIRECT
NetJ49_2: J49.2 R13.2 U12.25(PC5) ; port LED_7
NetJ49_3: J49.3 R12.2 U12.20(PA4) ; port LED_6
NetJ49_4: J49.4 R11.2 U12.52(PC11) ; port LED_5
NetJ49_5: J49.5 R10.2 U12.35(PB14) ; port LED_4
NetJ52_2: J52.2 P11.2 U12.46(PA13) ; port SWDIO
NetJ52_3: J52.3 P11.3 U12.49(PA14) ; port SWCLC
NetJ53_3: J53.3 P12.4 R7.2 U12.30(PB11) ; port LED_1
NetJ53_4: J53.4 P12.3 R8.2 U12.33(PB12) ; port LED_2
NetJ53_5: J53.5 P12.2 R9.2 U12.34(PB13) ; port LED_3
NetP1_2: P1.2 R1.1
NetP2_2: P2.2 R2.1
NetP3_2: P3.2 R3.1
NetP4_2: P4.2 R22.1
NetP5_2: P5.2 R23.1
NetP8_2: P8.2 R122.2
NetP8_3: P8.3 R123.2
NetP10_2: P10.2 R121.1 R123.1 U12.61(PB8) VD18.1(C) ; port SCL
NetP10_3: P10.3 R120.1 R122.1 U12.62(PB9) VD1.1(C) ; port SDA
NetP13_2: P13.2 U12.14(PA0) ; port SENS_1
NetP14_2: P14.2 U12.15(PA1) ; port SENS_2
NetP15_2: P15.2 U12.16(PA2) ; port SENS_3
NetP16_2: P16.2 U12.17(PA3) ; port SENS_4
NetQ1_1: Q1.1(B) R84.2 R88.1
NetQ2_1: Q2.1(B) R111.2 R113.1
NetQ3_1: Q3.1(B) R140.2 R143.1
NetQ4_1: Q4.1(B) R157.2 R159.1
NetR22_2: R22.2 R29.2 TP8.1(G9) U12.50(PA15) ; port TIME_in_1
NetR23_2: R23.2 R30.2 TP7.1(G9) U12.29(PB10) ; port TIME_in_2
NetR26_1: R26.1 R32.1 TP9.1(G9) U3.4(DI)
NetR27_1: R27.1 R36.1 TP16.1(G9) U3.1(RO)
NetR32_2: R32.2 U4.13(VOB)
NetR36_2: R36.2 U4.11(VID)
NetR38_2: R38.2 TP13.1(G9) U3.2(~{RE}) U3.3(DE) U4.12(VOC)
NetR54_2: R54.2 U7.1(SWC) U7.7(IPK) U7.8(DRC)
NetR56_2: R56.2 R57.2 U7.5(CII)
NetR59_2: R59.2 U12.60(BOOT0) ; port BOOT
NetR66_2: R66.2 TP40.1(G9) U12.43(PA10) U15.2(A) ; port PWM_3_1
NetR67_2: R67.2 TP42.1(G9) U12.41(PA8) U17.2(A) ; port PWM_1_1
NetR68_2: R68.2 TP37.1(G9) U14.2(INB) U15.4(Y) U16.2(A) ; port PWM_3_1_INV
NetR69_2: R69.2 TP41.1(G9) U14.1(INA) U16.4(Y) ; port PWM_3_1_STR
NetR70_2: R70.2 TP38.1(G9) U13.2(INB) U17.4(Y) U18.2(A) ; port PWM_1_1_INV
NetR71_2: R71.2 TP43.1(G9) U13.1(INA) U18.4(Y) ; port PWM_1_1_STR
NetR84_1: R84.1 U12.53(PC12) ; port PORT_1
NetR97_2: R97.2 TP57.1(G9) U12.44(PA11) U22.2(A) ; port PWM_1_2
NetR98_2: R98.2 TP59.1(G9) U12.36(PB15) U24.2(A) ; port PWM_3_2
NetR99_2: R99.2 TP53.1(G9) U21.2(INB) U22.4(Y) U23.2(A) ; port PWM_1_2_INV
NetR100_2: R100.2 TP58.1(G9) U21.1(INA) U23.4(Y) ; port PWM_1_2_STR
NetR101_2: R101.2 TP54.1(G9) U20.2(INB) U24.4(Y) U25.2(A) ; port PWM_3_2_INV
NetR102_2: R102.2 TP60.1(G9) U20.1(INA) U25.4(Y) ; port PWM_3_2_STR
NetR111_1: R111.1 U12.2(PC13) ; port PORT_2
NetR125_2: R125.2 TP73.1(G9) U12.42(PA9) U27.2(A) ; port PWM_2_1
NetR126_2: R126.2 TP75.1(G9) U12.37(PC6) U29.2(A) ; port PWM_4_1
NetR127_2: R127.2 TP71.1(G9) U27.4(Y) U28.2(A) U32.2(INB) ; port PWM_2_1_INV
NetR128_2: R128.2 TP74.1(G9) U28.4(Y) U32.1(INA) ; port PWM_2_1_STR
NetR129_2: R129.2 TP72.1(G9) U29.4(Y) U30.2(A) U31.2(INB) ; port PWM_4_1_INV
NetR130_2: R130.2 TP76.1(G9) U30.4(Y) U31.1(INA) ; port PWM_4_1_STR
NetR140_1: R140.1 U12.3(PC14/OSC32_IN) ; port PORT_3
NetR157_1: R157.1 U12.4(PC15/OSC32_OUT) ; port PORT_4
NetR161_2: R161.2 TP94.1(G9) U12.45(PA12) U35.2(A) ; port PWM_2_2
NetR162_2: R162.2 TP96.1(G9) U12.51(PC10) U37.2(A) ; port PWM_4_2
NetR163_2: R163.2 TP89.1(G9) U35.4(Y) U36.2(A) U40.2(INB) ; port PWM_2_2_INV
NetR164_2: R164.2 TP95.1(G9) U36.4(Y) U40.1(INA) ; port PWM_2_2_STR
NetR165_2: R165.2 TP93.1(G9) U37.4(Y) U38.2(A) U39.2(INB) ; port PWM_4_2_INV
NetR166_2: R166.2 TP97.1(G9) U38.4(Y) U39.1(INA) ; port PWM_4_2_STR
NetU12_18: U12.18(PF4) ; port ADC_1

Not connected (* = marked no-connect by the designer): U4 3(VIA) 14(VOA); U13 7(NC) 12(NC) 13(NC); U14 7(NC) 12(NC) 13(NC); U20 7(NC) 12(NC) 13(NC); U21 7(NC) 12(NC) 13(NC); U31 7(NC) 12(NC) 13(NC); U32 7(NC) 12(NC) 13(NC); U39 7(NC) 12(NC) 13(NC); U40 7(NC) 12(NC) 13(NC)

### Notes on the sheet
- (in symbol MCP6001T) +; -

### Library data of the parts
C1-C8 C10-C19 C25-C29 C36 C40-C42 C45 C46 C48 C52-C54 C76 C81 C89 C127 = CAP-NON-POLAR
C9 = CMP-1036-04552-2: CAP CER 0.22UF 50V X7R 0805; Manufacturer: KEMET; Value: 0.22 μF; Temperature Coefficient: 30ppm/°C; Material: Ceramic; Tolerance: 0.1; ComponentLink2URL: https://content.kemet.com/datasheets/KEM_C1003_C0G_SMD.pdf; Temperature Characteristic: X7R; Device Class L3: Ceramic Capacitors; Lead Free: Yes; Temperature: -55°C to +125°C; RoHS: TRUE; Capacitance: 0.22 μF; Automotive: No; Octopart: https://octopart.com/c0805c224k5ractu-kemet-144670; Manufacturer Part Number: C0805C224K5RACTU; Temperature Range Low: -55°C; Height: 0.88mm; Device Class L1: Passive Components; Digikey Description: CAP CER 0.22UF 50V X7R 0805; ComponentLink2Description: Datasheet; Mouser Description: CAP CER 0.22UF 50V X7R 0805; Category: Cap; Ipc Land Pattern Name: CAPC200125X78; Temperature Range High: +125°C; Package: C0805C-DN; Device Class L2: Capacitors; Voltage Rating: 50 V
C33 C43 C44 C47 C49-C51 C58 C60 C71 C73 C87 C88 C103 C104 C114 C117 C137 C139 C148 C150 C168 C170 = CAP-POLAR
C38 C39 = CAP_POL_SMD
C55 C56 = CMP-2007-03453-2: Chip Multilayer Ceramic Capacitors for General Purpose, 0805, 16pF, X5R, 15%, 10%, 16V; Capacitance: 10uF; Radiation Hardening: No; Thickness: 0.053inch; Voltage Rating (DC): 16V; Lead Free: Lead Free; Package Quantity: 1; Width: 1.25mm; Case Code (Imperial): 0805; Depth: 1.25mm; Packaging: Tape and Reel; Dielectric: X5R; Max Operating Temperature: 85°C; Tolerance: 10%; Voltage Rating: 16V; Voltage: 16V; Height: 1.25mm; Case Code (Metric): 2012; Material: Ceramic; Mount: Surface Mount; Case/Package: 0805; REACH SVHC: No SVHC; Length: 2mm; Min Operating Temperature: -55°C; Termination: SMD/SMT
D1-D8 D11 D22 = LED: WURTH ELEKTRONIK - 151031YS06000 - LED, Yellow, Through Hole, T-1 (3mm), 30 mA, 2 V, 590 nm; Geometry.Height: 5.5mm; Manufacturer_Name: Wurth Elektronik; Manufacturer_Part_Number: 151031YS06000; Mouser Part Number: 710-151031YS06000; Mouser Price/Stock: https://www.mouser.co.uk/ProductDetail/Wurth-Elektronik/151031YS06000?qs=LlUlMxKIyB3xSYYW%252BcuBiQ%3D%3D; Arrow Part Number: *; Arrow Price/Stock: *; Mouser Testing Part Number: *; Mouser Testing Price/Stock: *; Datasheet Link: https://katalog.we-online.de/led/datasheet/151031YS06000.pdf
J8 = 691101710003: WR-TBL Series 101 Horizontal Entry Modular, Through Hole, pitch 5mm, 3p; Manufacturer: Wurth Elektronik; Pin Number: 3; Rated Current: 16A; Working Voltage: 250V; PCB/Cable/Panel: PCB; Modularity: Yes; ComponentLink1Description: Manufacturer Link; ComponentLink1URL: https://www.we-online.com/redexpert/article/691101710003?ad; ComponentLink2Description: Datasheet; ComponentLink2URL: https://www.we-online.com/redexpert/spec/691101710003?ad; Category: Terminal Blocks; Match Code: WR-TBL; Manufacturer Part Number: 691101710003; Mount: Through Hole; Operating Temperature Max: 105°C; Operating Temperature Min: -40°C; Packaging: Box; Pitch: 5mm; Orientation: Horizontal; Application: Pressure Clamp
J9 = 691101710002: WR-TBL Series 101 Horizontal Entry Modular, THT, pitch 5mm, 2p; Manufacturer: Wurth Elektronik; Modularity: Yes; Rated Current: 16A; Working Voltage: 250V; ComponentLink1Description: Website Link; ComponentLink1URL: https://www.we-online.com/redexpert/article/691101710002?ad; ComponentLink2Description: Datasheet Link; ComponentLink2URL: https://www.we-online.com/redexpert/spec/691101710002?ad; Manufacturer Part Number: 691101710002; Category: Terminal Blocks; Match Code: WR-TBL; Mount: Through Hole; Operating Temperature Max: 105°C; Operating Temperature Min: -40°C; Packaging: Box; Application: Pressure Clamp; Number of Pins: 2; Number of Rows: 1; Orientation: Horizontal; Pitch: 5mm
J14-J17 J19-J26 J28-J32 J34-J40 J42-J47 J50 J51 = Klema_15_A
J48 J49 J52 J53 = SWR25X-NRTC-S06-ST-BA
L3 L4 = CMP-0227-00501-2: NexarPartId: 24533346; Inductance: 270µH; Current Rating: 620mA; Self Resonant Frequency: 4MHz; DC Resistance (DCR): 500mΩ; Ambient Temperature Range Low: -40°C; Min Operating Temperature: -40°C; RoHS: Compliant; Ambient Temperature Range High: 85°C; Packaging: Digi-Reel®; Height: 5.4mm; Length: 9mm; Max Operating Temperature: 125°C; Width: 10mm
L5-L7 = 74477530: WE-PD2 SMT Power Inductor, size 7850, 1000µH, 0.3A, 3.3Ω; Manufacturer: Wurth Elektronik; Case/Size Code: 7850; DC Resistance: 2.78Ω; Self Resonant Frequency: 2.4MHz; Manufacturer Part Number: 74477530; Category: Unshielded Power Inductors; Match Code: WE-PD2; ComponentLink1Description: Website Link; ComponentLink1URL: https://www.we-online.com/redexpert/article/74477530?ad; ComponentLink2Description: Datasheet Link; ComponentLink2URL: https://www.we-online.com/redexpert/spec/74477530?ad; Mount: Surface Mount; Operating Temperature Max: 125°C; Operating Temperature Min: -40°C; Packaging: Tape and Reel; Length: 7.8mm; Width: 7mm; Height: 4.95mm; DC Resistance Max: 3.3Ω; Inductance: 1000µH; Rated Current: 0.3A; Saturation Current: 0.3A
P1-P5 P13-P16 = 61900311121: WR-WTB THT Male Vertical Locking Header, pitch 2.54mm, 3p; Pin Number: 3; Contact Resistance: 20mOhm; Rated Current: 3A; Withstanding Voltage: 1000VAC; Working Voltage: 250VAC; ComponentLink1Description: Manufacturer; ComponentLink1URL: http://www.we-online.de; ComponentLink2Description: Datasheet; ComponentLink2URL: https://www.we-online.com/catalog/datasheet/61900311121.pdf; Pitch: 2.54mm; Published Date: January 2020; Publisher: Wurth Elektronik; Mounting Technology: THT; Packaging: Bag; Operating Temperature: -40 to +105degC; Part Number: 61900311121; Gender: Male; Type: Vertical
P6 P7 P9 = 61900211121: WR-WTB THT Male Vertical Locking Header, pitch 2.54mm, 2p; Pin Number: 2; Contact Resistance: 20mOhm; Rated Current: 3A; Withstanding Voltage: 1000VAC; Working Voltage: 250VAC; ComponentLink1Description: Manufacturer; ComponentLink1URL: http://www.we-online.de; ComponentLink2Description: Datasheet; ComponentLink2URL: https://www.we-online.com/catalog/datasheet/61900211121.pdf; Pitch: 2.54mm; Published Date: January 2020; Publisher: Wurth Elektronik; Mounting Technology: THT; Packaging: Bag; Operating Temperature: -40 to +105degC; Part Number: 61900211121; Gender: Male; Type: Vertical
P8 = 62000411622: WR-WTB Male Vertical Shrouded Header, pitch 2mm, 4p; Pin Number: 4; Contact Resistance: 20mOhm; Rated Current: 2A; Withstanding Voltage: 800VAC; Working Voltage: 125VAC; ComponentLink1Description: Manufacturer; ComponentLink1URL: http://www.we-online.de; ComponentLink2Description: Datasheet; ComponentLink2URL: https://www.we-online.com/catalog/datasheet/62000411622.pdf; Pitch: 2mm; Published Date: January 2020; Publisher: Wurth Elektronik; Mounting Technology: THT; Packaging: Bag; Operating Temperature: -25 to +85degC; Part Number: 62000411622; Gender: Male; Type: Vertical
P10 P12 = 61300511121: WR-PHD Pin Header, THT, Vertical, pitch 2.54mm, 1 Row, 5P; Manufacturer: Wurth Elektronik; Contact Resistance: 20mΩ; Rated Current: 3A; Working Voltage: 250V; Withstanding Voltage: 500V; ComponentLink1Description: Website Link; ComponentLink1URL: https://www.we-online.com/redexpert/article/61300511121?ad; ComponentLink2Description: Datasheet Link; ComponentLink2URL: https://www.we-online.com/redexpert/spec/61300511121?ad; Manufacturer Part Number: 61300511121; Category: Board-to-Board Connectors; Match Code: WR-PHD; Mount: Through Hole; Operating Temperature Max: 105°C; Operating Temperature Min: -40°C; Packaging: Bag; Gender: Pin Header; Number of Pins: 5; Number of Rows: 1; Orientation: Vertical; Pitch: 2.54mm
P11 = CMP-1024-00357-1: 0.025" SQ Post Header, Through-hole, Vertical, -55 to 125 degC, 2.54 mm Pitch, 4-Pin, Male, RoHS; Manufacturer: Samtec; Pitch: 2.54 mm; RoHS: True; ComponentLink3URL: http://www.samtec.com/documents/webfiles/cpdf/TSW-XXX-XX-XXX-X-XX-XXX-MKT.pdf; Mounting Technology: Through-hole; ComponentLink2URL: http://www.samtec.com/documents/webfiles/pdf/TSW_TH.PDF; ComponentLink1URL: http://www.samtec.com; ComponentLink3Description: Package Specification; PackageVersion: DM, 8/1988; ComponentLink2Description: Datasheet; PackageReference: TSW-104-08-X-S; PackageDescription: .025[0.64] SQ. Post Terminal Strip Assembly; PartNumber: TSW-104-08-G-S; ComponentLink1Description: Manufacturer URL; Temperature Range: -55 to 125 degC; DatasheetVersion: F-214; Orientation: Vertical
Q1-Q4 = BC847C_Infineon: NPN Silicon AF Transistor, 45 V VCEO, 100 mA IC, SOT23, Reel, Green; Ptot (max): 330Â mW; VEBO (max): 6Â V; IBM (max): 200Â mA; VCBO (max): 50Â V; Green: TRUE; fT (typ): 250Â MHz; VCEO (max): 45Â V; IC (max): 100Â mA; ICBO (max): 15Â nA; Polarity: NPN; PartNumber: BC847C; PackageVersion: Apr-08; ComponentLink1Description: Manufacturer URL; ComponentLink2Description: Datasheet; ComponentLink3URL: http://www.infineon.com/dgdl/SOT23-Package_Overview.pdf?folderId=db3a30431936bc4b0119532290053c66&fileId=db3a30431936bc4b0119533468123c85; ComponentLink3Description: Package Specification; ComponentLink1URL: http://www.infineon.com/; Packing: Reel; ComponentLink2URL: http://www.infineon.com/dgdl/bc847series_bc848series_bc849series_bc850series.pdf?folderId=db3a304314dca389011541d30fa21656&fileId=db3a304314dca389011541d4630a1657; Manufacturer: Infineon; ICM (max): 200Â mA; Mounting Technology: Surface Mount; PackageReference: SOT23; PackageDescription: 3-Pin Small Outline Transistor Package, 1.3 x 2.9 mm Body, 0.95 mm Pitch
R1-R13 R22-R30 R32 R36 R38-R41 R49-R55 R57-R78 R81-R84 R86-R108 R111 R113-R137 R140 R142-R154 R157 R159-R173 R175-R181 = RES-CONST
R56 = RES-CONST: 10K
R174 = RES-CONST: 100K
TP1-TP3 TP5-TP11 TP13 TP14 TP16 TP20-TP26 TP28-TP30 TP32-TP45 TP49-TP63 TP67-TP79 TP83-TP89 TP93-TP105 = TP_PCB?: Test_Point
U1 U6 U8 U10 U41 U42 = DC-DC/12-18VDC
U4 = CMP-0534-00565-1: Quad Channel Digital Isolator, 2.5 KV rms Insulation Rating, 10 Mbps Data Rate, 50 ns Delay, Industrial, 16-pin SOIC (RW-16), Tube; Manufacturer: Analog Devices; Max Data Rate: 10Mbps; ComponentLink2URL: http://www.analog.com/static/imported-files/data_sheets/ADuM1400_1401_1402.pdf; ComponentLink5Description: URL Link2; ComponentLink3URL: http://www.analog.com/static/imported-files/packages/PKG_PDF/SOIC_WIDE%20%28RW%29/RW_16.pdf; DatasheetVersion: Rev. H; ComponentLink2Description: Datasheet; ComponentLink3Description: Package Specification; PartNumber: ADUM1401BRWZ; ComponentLink5URL: Reference Circuit:http://www.analog.com/en/interface-isolation/digital-isolators/adum1401/products/product.html#product-recommendations; Max Operating Temp (degreesC): 125; PackageReference: RW-16; PackageVersion: 032707-B, 03/2007; ComponentLink1Description: Manufacturer URL; Code_JEDEC: MS-013-AA; PackageDescription: 16-Pin Standard Small Outline Package, Body 10.3 x 7.5 mm, Pitch 1.27 mm; Mounting Technology: Surface Mount; ComponentLink1URL: http://www.analog.com/en/index.html; ComponentLink4Description: URL Link1; ComponentLink4URL: Product URL:http://www.analog.com/en/interface-isolation/digital-isolators/adum1401/products/product.html
U5 = MCP6001T: IC OPAMP GP 1 CIRCUIT SOT23-5; Number of Amplifiers: 1; Voltage: 6V; Power Supply Rejection Ratio (PSRR): 86dB; Common Mode Rejection Ratio: 60dB; Unity Gain Bandwidth Product: 1MHz; Slew Rate: 0.6V/µs; Output Current per Channel: 23mA; Nominal Supply Current: 100uA; Input Offset Voltage (Vos): 4.5mV; Input Bias Current: 1pA; Operating Supply Voltage: 5.5V; Min Supply Voltage: 1.8V; Voltage Gain: 112dB; Length: 3.1mm; REACH SVHC: No SVHC; Number of Pins: 5; Package Quantity: 1; Radiation Hardening: No; Mount: Surface Mount; Number of Circuits: 1; Number of Elements: 1; Output Current: 23mA; Packaging: Tape and Reel; Height: 1.3mm; Lead Free: Lead Free; Min Operating Temperature: -40°C; Bandwidth: 1MHz; Contact Plating: Tin; Max Supply Voltage: 6V; Max Operating Temperature: 85°C; Width: 1.8mm; Case/Package: SOT-23; Operating Supply Current: 100uA; Number of Channels: 1; Gain Bandwidth Product: 1MHz
U9 U11 = AMS1117
VD1 VD18 = ESD_Unidirect
VD2 VD3 VD6 VD7 VD10 VD11 VD14 VD15 VD20 VD21 VD24 VD25 VD28 VD29 VD32 VD33 = Suppressor
VD4 VD5 VD8 VD9 VD12 VD13 VD16 VD17 VD22 VD23 VD26 VD27 VD30 VD31 VD34 VD35 = ZENER
Y1 = CMP-1749-00004-1: Resistance Weld Thru-Hole Crystal, 12 MHz, +/-30 ppm, -20 to 70 degC, 2-Pin THD, RoHS, Bulk; Elements: 1; Rds On Max: 115 mohm; Typical Rise Time: 90 ns; Max Power Dissipation: 2.5 W; Case\Package: TO-251-3; Input Capacitance: 350 pF; REACH SVHC: No SVHC; Length: 6.6 mm; ComponentLink1URL: http://www.foxonline.com/; PackageDescription: 2-Pin Through Hole Device, Body 11.35 x 4.65 mm, Pitch 4.88 mm; Radiation Hardening: No; Package Quantity: 70; Packaging: Rail/Tube; ComponentLink1Description: Manufacturer URL; Min Operating Temperature: -55 degC; Max Operating Temperature: 150 degC; RoHSCompliant: true; PackageReference: FOXSLF-2; DatasheetVersion: Mar-15; Pins: 3; Height: 6.1 mm; Mount: Through Hole; ComponentLink2URL: http://www.foxonline.com/pdfs/hc49slf.pdf; ComponentLink2Description: Datasheet; Width: 2.3 mm